# EAGLE design tester-7410 (EAGLE 6.6.0)

## Sheet 1 of 2
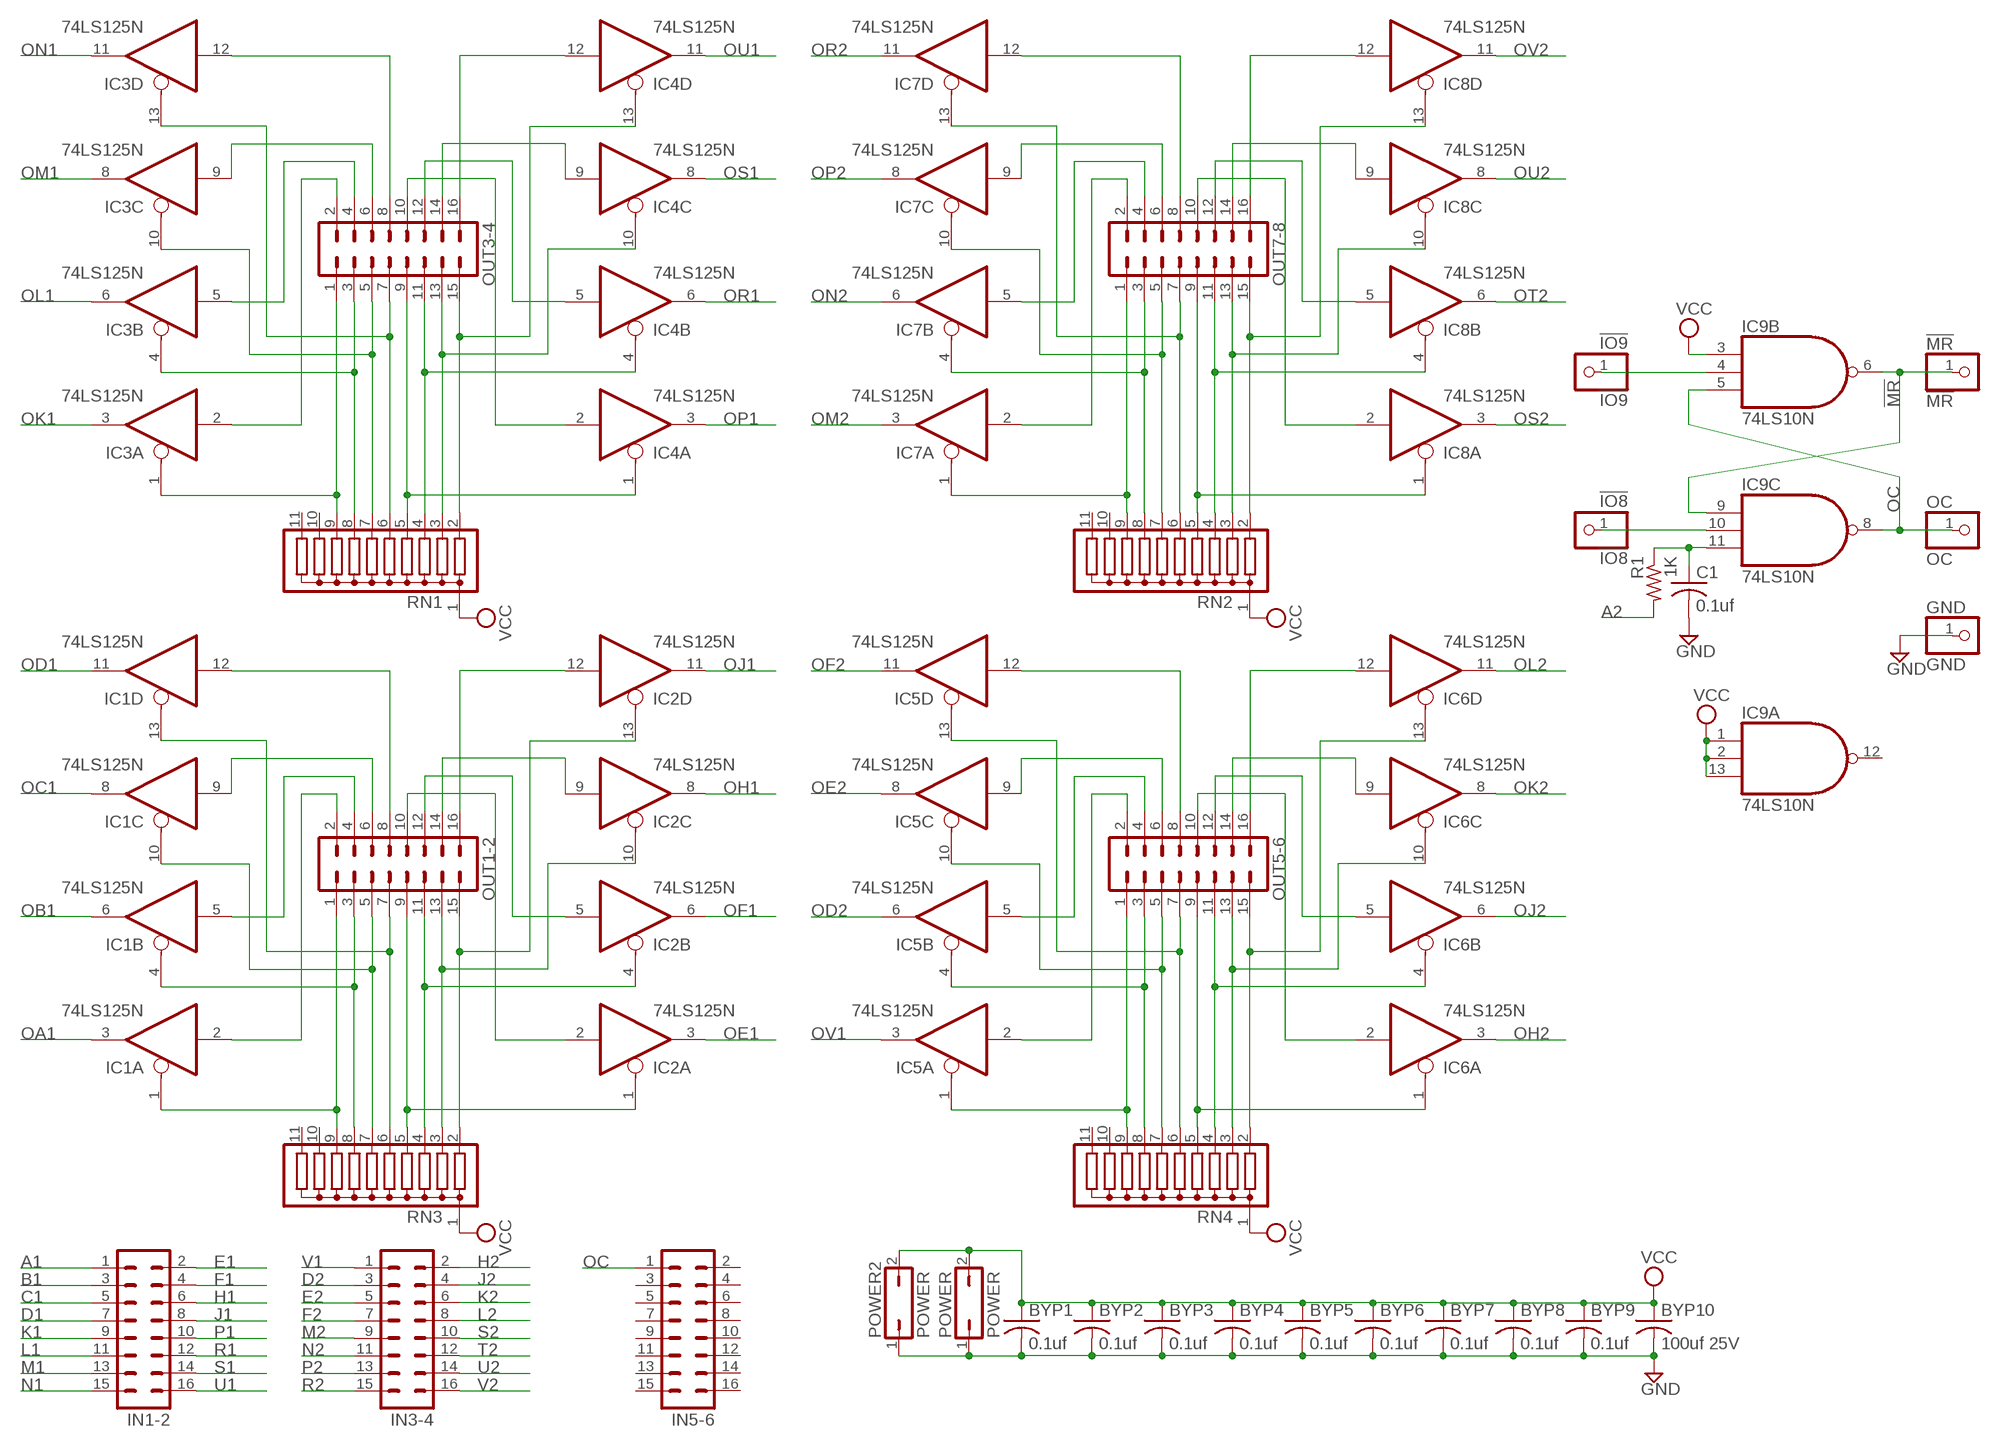
[diagram p0: schematic, sheet 1]

### Parts
!IO8  !IO8  PINHD-1X1  [1X01]
!IO9  !IO9  PINHD-1X1  [1X01]
!MR  !MR  PINHD-1X1  [1X01]
BYP1  0.1uf  C-US050-025X075  [C050-025X075]
BYP2  0.1uf  C-US050-025X075  [C050-025X075]
BYP3  0.1uf  C-US050-025X075  [C050-025X075]
BYP4  0.1uf  C-US050-025X075  [C050-025X075]
BYP5  0.1uf  C-US050-025X075  [C050-025X075]
BYP6  0.1uf  C-US050-025X075  [C050-025X075]
BYP7  0.1uf  C-US050-025X075  [C050-025X075]
BYP8  0.1uf  C-US050-025X075  [C050-025X075]
BYP9  0.1uf  C-US050-025X075  [C050-025X075]
BYP10  100uf 25V  C-US150-064X183  [C150-064X183]
C1  0.1uf  C-US050-025X075  [C050-025X075]
GND  GND  PINHD-1X1  [1X01]
IC1  74LS125N  [DIL14]
IC2  74LS125N  [DIL14]
IC3  74LS125N  [DIL14]
IC4  74LS125N  [DIL14]
IC5  74LS125N  [DIL14]
IC6  74LS125N  [DIL14]
IC7  74LS125N  [DIL14]
IC8  74LS125N  [DIL14]
IC9  74LS10N  [DIL14]
IN1-2  MA08-2  [MA08-2]
IN3-4  MA08-2  [MA08-2]
IN5-6  MA08-2  [MA08-2]
OC  OC  PINHD-1X1  [1X01]
OUT1-2  MA08-2  [MA08-2]
OUT3-4  MA08-2  [MA08-2]
OUT5-6  MA08-2  [MA08-2]
OUT7-8  MA08-2  [MA08-2]
POWER  POWER  JP1Q  [JP1]
POWER2  POWER  JP1Q  [JP1]
R1  1K  R-US_0207/10  [0207/10]
RN1  G10R  [SIL11]
RN2  G10R  [SIL11]
RN3  G10R  [SIL11]
RN4  G10R  [SIL11]

### Nets
!IO8: !IO8.1 IC9.10(C:I1)
!IO9: !IO9.1 IC9.4(B:I1)
!MR: !MR.1 IC9.6(B:O) IC9.9(C:I0)
A1: IN1-2.1 ; also sheet 2
A2: R1.2 ; also sheet 2
B1: IN1-2.3 ; also sheet 2
C1: IN1-2.5 ; also sheet 2
D1: IN1-2.7 ; also sheet 2
D2: IN3-4.3 ; also sheet 2
E1: IN1-2.2 ; also sheet 2
E2: IN3-4.5 ; also sheet 2
F1: IN1-2.4 ; also sheet 2
F2: IN3-4.7 ; also sheet 2
GND [Power]: BYP1.2 BYP2.2 BYP3.2 BYP4.2 BYP5.2 BYP6.2 BYP7.2 BYP8.2 BYP9.2 BYP10.2 C1.2 GND.1 POWER2.1 POWER.1 ; also sheet 2
H1: IN1-2.6 ; also sheet 2
H2: IN3-4.2 ; also sheet 2
J1: IN1-2.8 ; also sheet 2
J2: IN3-4.4 ; also sheet 2
K1: IN1-2.9 ; also sheet 2
K2: IN3-4.6 ; also sheet 2
L1: IN1-2.11 ; also sheet 2
L2: IN3-4.8 ; also sheet 2
M1: IN1-2.13 ; also sheet 2
M2: IN3-4.9 ; also sheet 2
N1: IN1-2.15 ; also sheet 2
N2: IN3-4.11 ; also sheet 2
N$5: C1.1 IC9.11(C:I2) R1.1
N$53: IC1.1(A:OE) OUT1-2.1 RN3.9
N$54: IC1.4(B:OE) OUT1-2.3 RN3.8
N$55: IC1.10(C:OE) OUT1-2.5 RN3.7
N$56: IC1.13(D:OE) OUT1-2.7 RN3.6
N$57: IC1.2(A:I) OUT1-2.2
N$58: IC1.5(B:I) OUT1-2.4
N$59: IC1.9(C:I) OUT1-2.6
N$60: IC1.12(D:I) OUT1-2.8
N$61: IC5.4(B:OE) OUT5-6.3 RN4.8
N$62: IC2.10(C:OE) OUT1-2.13 RN3.3
N$63: IC2.4(B:OE) OUT1-2.11 RN3.4
N$64: IC2.1(A:OE) OUT1-2.9 RN3.5
N$65: IC2.2(A:I) OUT1-2.10
N$66: IC2.5(B:I) OUT1-2.12
N$67: IC2.9(C:I) OUT1-2.14
N$68: IC2.12(D:I) OUT1-2.16
N$138: IC5.13(D:OE) OUT5-6.7 RN4.6
N$139: IC2.13(D:OE) OUT1-2.15 RN3.2
N$140: IC5.2(A:I) OUT5-6.2
N$141: IC5.5(B:I) OUT5-6.4
N$142: IC5.9(C:I) OUT5-6.6
N$143: IC5.12(D:I) OUT5-6.8
N$144: IC6.10(C:OE) OUT5-6.13 RN4.3
N$145: IC6.4(B:OE) OUT5-6.11 RN4.4
N$146: IC6.1(A:OE) OUT5-6.9 RN4.5
N$147: IC6.2(A:I) OUT5-6.10
N$148: IC6.9(C:I) OUT5-6.14
N$149: IC6.12(D:I) OUT5-6.16
N$150: IC5.1(A:OE) OUT5-6.1 RN4.9
N$151: IC5.10(C:OE) OUT5-6.5 RN4.7
N$152: IC6.5(B:I) OUT5-6.12
N$153: IC6.13(D:OE) OUT5-6.15 RN4.2
N$154: IC3.4(B:OE) OUT3-4.3 RN1.8
N$155: IC3.13(D:OE) OUT3-4.7 RN1.6
N$156: IC3.2(A:I) OUT3-4.2
N$157: IC3.5(B:I) OUT3-4.4
N$158: IC3.9(C:I) OUT3-4.6
N$159: IC3.12(D:I) OUT3-4.8
N$160: IC4.10(C:OE) OUT3-4.13 RN1.3
N$161: IC4.4(B:OE) OUT3-4.11 RN1.4
N$162: IC4.1(A:OE) OUT3-4.9 RN1.5
N$163: IC4.2(A:I) OUT3-4.10
N$164: IC4.9(C:I) OUT3-4.14
N$165: IC4.12(D:I) OUT3-4.16
N$166: IC3.1(A:OE) OUT3-4.1 RN1.9
N$167: IC3.10(C:OE) OUT3-4.5 RN1.7
N$168: IC4.5(B:I) OUT3-4.12
N$169: IC4.13(D:OE) OUT3-4.15 RN1.2
N$170: IC7.4(B:OE) OUT7-8.3 RN2.8
N$171: IC7.13(D:OE) OUT7-8.7 RN2.6
N$172: IC7.2(A:I) OUT7-8.2
N$173: IC7.5(B:I) OUT7-8.4
N$174: IC7.9(C:I) OUT7-8.6
N$175: IC7.12(D:I) OUT7-8.8
N$176: IC8.10(C:OE) OUT7-8.13 RN2.3
N$177: IC8.4(B:OE) OUT7-8.11 RN2.4
N$178: IC8.1(A:OE) OUT7-8.9 RN2.5
N$179: IC8.2(A:I) OUT7-8.10
N$180: IC8.9(C:I) OUT7-8.14
N$181: IC8.12(D:I) OUT7-8.16
N$182: IC7.1(A:OE) OUT7-8.1 RN2.9
N$183: IC7.10(C:OE) OUT7-8.5 RN2.7
N$184: IC8.5(B:I) OUT7-8.12
N$185: IC8.13(D:OE) OUT7-8.15 RN2.2
OA1: IC1.3(A:O) ; also sheet 2
OB1: IC1.6(B:O) ; also sheet 2
OC: IC9.5(B:I2) IC9.8(C:O) IN5-6.1 OC.1
OC1: IC1.8(C:O) ; also sheet 2
OD1: IC1.11(D:O) ; also sheet 2
OD2: IC5.6(B:O) ; also sheet 2
OE1: IC2.3(A:O) ; also sheet 2
OE2: IC5.8(C:O) ; also sheet 2
OF1: IC2.6(B:O) ; also sheet 2
OF2: IC5.11(D:O) ; also sheet 2
OH1: IC2.8(C:O) ; also sheet 2
OH2: IC6.3(A:O) ; also sheet 2
OJ1: IC2.11(D:O) ; also sheet 2
OJ2: IC6.6(B:O) ; also sheet 2
OK1: IC3.3(A:O) ; also sheet 2
OK2: IC6.8(C:O) ; also sheet 2
OL1: IC3.6(B:O) ; also sheet 2
OL2: IC6.11(D:O) ; also sheet 2
OM1: IC3.8(C:O) ; also sheet 2
OM2: IC7.3(A:O) ; also sheet 2
ON1: IC3.11(D:O) ; also sheet 2
ON2: IC7.6(B:O) ; also sheet 2
OP1: IC4.3(A:O) ; also sheet 2
OP2: IC7.8(C:O) ; also sheet 2
OR1: IC4.6(B:O) ; also sheet 2
OR2: IC7.11(D:O) ; also sheet 2
OS1: IC4.8(C:O) ; also sheet 2
OS2: IC8.3(A:O) ; also sheet 2
OT2: IC8.6(B:O) ; also sheet 2
OU1: IC4.11(D:O) ; also sheet 2
OU2: IC8.8(C:O) ; also sheet 2
OV1: IC5.3(A:O) ; also sheet 2
OV2: IC8.11(D:O) ; also sheet 2
P1: IN1-2.10 ; also sheet 2
P2: IN3-4.13 ; also sheet 2
R1: IN1-2.12 ; also sheet 2
R2: IN3-4.15 ; also sheet 2
S1: IN1-2.14 ; also sheet 2
S2: IN3-4.10 ; also sheet 2
T2: IN3-4.12 ; also sheet 2
U1: IN1-2.16 ; also sheet 2
U2: IN3-4.14 ; also sheet 2
V1: IN3-4.1 ; also sheet 2
V2: IN3-4.16 ; also sheet 2
VCC [Power]: BYP1.1 BYP2.1 BYP3.1 BYP4.1 BYP5.1 BYP6.1 BYP7.1 BYP8.1 BYP9.1 BYP10.1 IC9.1(A:I0) IC9.2(A:I1) IC9.3(B:I0) IC9.13(A:I2) POWER2.2 POWER.2 RN1.1 RN2.1 RN3.1 RN4.1 ; also sheet 2
Unconnected: IC9.12(A:O) IN5-6.2 IN5-6.3 IN5-6.4 IN5-6.5 IN5-6.6 IN5-6.7 IN5-6.8 IN5-6.9 IN5-6.10 IN5-6.11 IN5-6.12 IN5-6.13 IN5-6.14 IN5-6.15 IN5-6.16 RN1.10 RN1.11 RN2.10 RN2.11 RN3.10 RN3.11 RN4.10 RN4.11

## Sheet 2 of 2
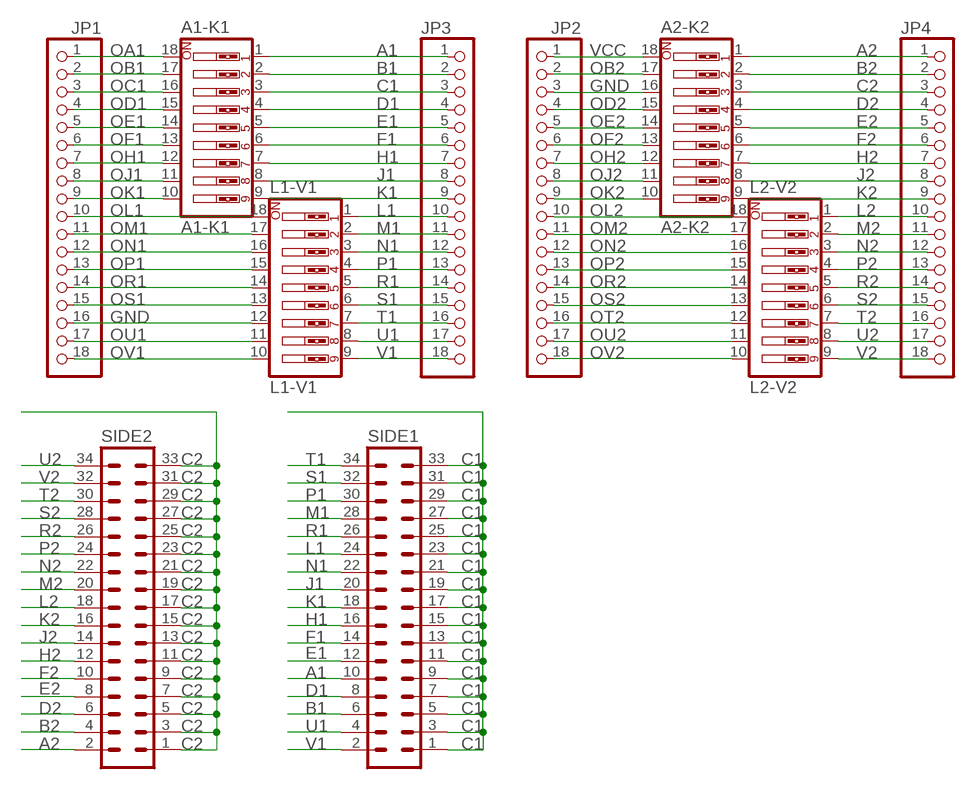
[diagram p1: schematic, sheet 2]

### Parts
A1-K1  A1-K1  SW_DIP-9  [EDG-09]
A2-K2  A2-K2  SW_DIP-9  [EDG-09]
JP1  PINHD-1X18  [1X18]
JP2  PINHD-1X18  [1X18]
JP3  PINHD-1X18  [1X18]
JP4  PINHD-1X18  [1X18]
L1-V1  L1-V1  SW_DIP-9  [EDG-09]
L2-V2  L2-V2  SW_DIP-9  [EDG-09]
SIDE1  MA17-2  [MA17-2]
SIDE2  MA17-2  [MA17-2]

### Nets
A1: A1-K1.1 JP3.1 SIDE1.10 ; also sheet 1
A2: A2-K2.1 JP4.1 SIDE2.2 ; also sheet 1
B1: A1-K1.2 JP3.2 SIDE1.6 ; also sheet 1
B2: A2-K2.2 JP4.2 SIDE2.4
C1: A1-K1.3 JP3.3 SIDE1.1 SIDE1.3 SIDE1.5 SIDE1.7 SIDE1.9 SIDE1.11 SIDE1.13 SIDE1.15 SIDE1.17 SIDE1.19 SIDE1.21 SIDE1.23 SIDE1.25 SIDE1.27 SIDE1.29 SIDE1.31 SIDE1.33 ; also sheet 1
C2: A2-K2.3 JP4.3 SIDE2.1 SIDE2.3 SIDE2.5 SIDE2.7 SIDE2.9 SIDE2.11 SIDE2.13 SIDE2.15 SIDE2.17 SIDE2.19 SIDE2.21 SIDE2.23 SIDE2.25 SIDE2.27 SIDE2.29 SIDE2.31 SIDE2.33
D1: A1-K1.4 JP3.4 SIDE1.8 ; also sheet 1
D2: A2-K2.4 JP4.4 SIDE2.6 ; also sheet 1
E1: A1-K1.5 JP3.5 SIDE1.12 ; also sheet 1
E2: A2-K2.5 JP4.5 SIDE2.8 ; also sheet 1
F1: A1-K1.6 JP3.6 SIDE1.14 ; also sheet 1
F2: A2-K2.6 JP4.6 SIDE2.10 ; also sheet 1
GND [Power]: A2-K2.16 JP1.16 JP2.3 L1-V1.12 ; also sheet 1
H1: A1-K1.7 JP3.7 SIDE1.16 ; also sheet 1
H2: A2-K2.7 JP4.7 SIDE2.12 ; also sheet 1
J1: A1-K1.8 JP3.8 SIDE1.20 ; also sheet 1
J2: A2-K2.8 JP4.8 SIDE2.14 ; also sheet 1
K1: A1-K1.9 JP3.9 SIDE1.18 ; also sheet 1
K2: A2-K2.9 JP4.9 SIDE2.16 ; also sheet 1
L1: JP3.10 L1-V1.1 SIDE1.24 ; also sheet 1
L2: JP4.10 L2-V2.1 SIDE2.18 ; also sheet 1
M1: JP3.11 L1-V1.2 SIDE1.28 ; also sheet 1
M2: JP4.11 L2-V2.2 SIDE2.20 ; also sheet 1
N1: JP3.12 L1-V1.3 SIDE1.22 ; also sheet 1
N2: JP4.12 L2-V2.3 SIDE2.22 ; also sheet 1
OA1: A1-K1.18 JP1.1 ; also sheet 1
OB1: A1-K1.17 JP1.2 ; also sheet 1
OB2: A2-K2.17 JP2.2
OC1: A1-K1.16 JP1.3 ; also sheet 1
OD1: A1-K1.15 JP1.4 ; also sheet 1
OD2: A2-K2.15 JP2.4 ; also sheet 1
OE1: A1-K1.14 JP1.5 ; also sheet 1
OE2: A2-K2.14 JP2.5 ; also sheet 1
OF1: A1-K1.13 JP1.6 ; also sheet 1
OF2: A2-K2.13 JP2.6 ; also sheet 1
OH1: A1-K1.12 JP1.7 ; also sheet 1
OH2: A2-K2.12 JP2.7 ; also sheet 1
OJ1: A1-K1.11 JP1.8 ; also sheet 1
OJ2: A2-K2.11 JP2.8 ; also sheet 1
OK1: A1-K1.10 JP1.9 ; also sheet 1
OK2: A2-K2.10 JP2.9 ; also sheet 1
OL1: JP1.10 L1-V1.18 ; also sheet 1
OL2: JP2.10 L2-V2.18 ; also sheet 1
OM1: JP1.11 L1-V1.17 ; also sheet 1
OM2: JP2.11 L2-V2.17 ; also sheet 1
ON1: JP1.12 L1-V1.16 ; also sheet 1
ON2: JP2.12 L2-V2.16 ; also sheet 1
OP1: JP1.13 L1-V1.15 ; also sheet 1
OP2: JP2.13 L2-V2.15 ; also sheet 1
OR1: JP1.14 L1-V1.14 ; also sheet 1
OR2: JP2.14 L2-V2.14 ; also sheet 1
OS1: JP1.15 L1-V1.13 ; also sheet 1
OS2: JP2.15 L2-V2.13 ; also sheet 1
OT2: JP2.16 L2-V2.12 ; also sheet 1
OU1: JP1.17 L1-V1.11 ; also sheet 1
OU2: JP2.17 L2-V2.11 ; also sheet 1
OV1: JP1.18 L1-V1.10 ; also sheet 1
OV2: JP2.18 L2-V2.10 ; also sheet 1
P1: JP3.13 L1-V1.4 SIDE1.30 ; also sheet 1
P2: JP4.13 L2-V2.4 SIDE2.24 ; also sheet 1
R1: JP3.14 L1-V1.5 SIDE1.26 ; also sheet 1
R2: JP4.14 L2-V2.5 SIDE2.26 ; also sheet 1
S1: JP3.15 L1-V1.6 SIDE1.32 ; also sheet 1
S2: JP4.15 L2-V2.6 SIDE2.28 ; also sheet 1
T1: JP3.16 L1-V1.7 SIDE1.34
T2: JP4.16 L2-V2.7 SIDE2.30 ; also sheet 1
U1: JP3.17 L1-V1.8 SIDE1.4 ; also sheet 1
U2: JP4.17 L2-V2.8 SIDE2.34 ; also sheet 1
V1: JP3.18 L1-V1.9 SIDE1.2 ; also sheet 1
V2: JP4.18 L2-V2.9 SIDE2.32 ; also sheet 1
VCC [Power]: A2-K2.18 JP2.1 ; also sheet 1

## Power pins joined to a net without a drawn wire
GND: IC1.7(P:GND) IC2.7(P:GND) IC3.7(P:GND) IC4.7(P:GND) IC5.7(P:GND) IC6.7(P:GND) IC7.7(P:GND) IC8.7(P:GND) IC9.7(P:GND)
VCC: IC1.14(P:VCC) IC2.14(P:VCC) IC3.14(P:VCC) IC4.14(P:VCC) IC5.14(P:VCC) IC6.14(P:VCC) IC7.14(P:VCC) IC8.14(P:VCC) IC9.14(P:VCC)

## Library data of the parts
!IO8 !IO9 !MR GND OC = pinhead:PINHD-1X1: PIN HEADER
A1-K1 A2-K2 L1-V1 L2-V2 = special:SW_DIP-9: DIP SWITCH
BYP1-BYP10 C1 = rcl:C-US: CAPACITOR, American symbol
IC1-IC8 = 74xx-us:74*125: Quad bus BUFFER, 3-state
IC9 = 74xx-us:74*10: Triple 3-input NAND gate
IN1-2 IN3-4 IN5-6 OUT1-2 OUT3-4 OUT5-6 OUT7-8 = con-lstb:MA08-2: PIN HEADER; OC_FARNELL: unknown; OC_NEWARK: unknown
JP1-JP4 = pinhead:PINHD-1X18: PIN HEADER
POWER POWER2 = jumper:JP1Q: JUMPER
R1 = rcl:R-US_: RESISTOR, American symbol
RN1-RN4 = resistor-sil:G10R: SIL RESISTOR; OC_FARNELL: unknown; OC_NEWARK: unknown
SIDE1 SIDE2 = con-lstb:MA17-2: PIN HEADER; OC_FARNELL: unknown; OC_NEWARK: unknown

## Net classes
1 Power: width 0.305 mm, clearance 0.305 mm

## Board
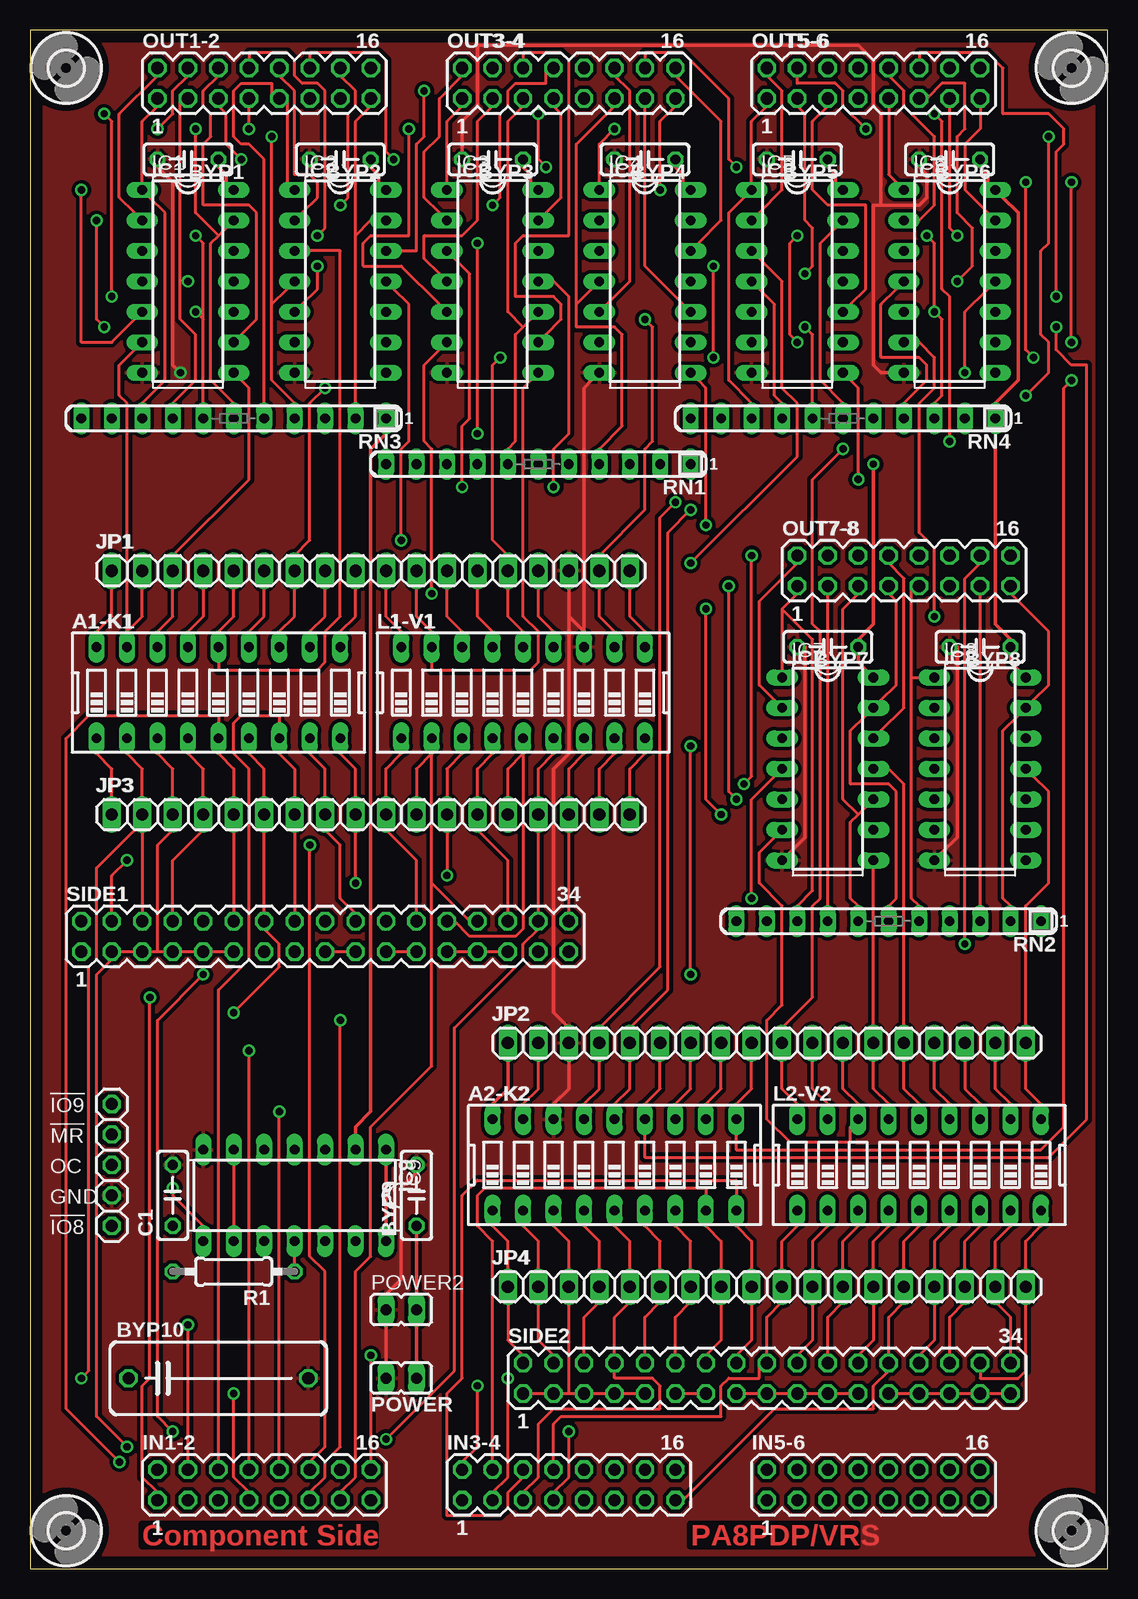
[diagram p2: board, top side]
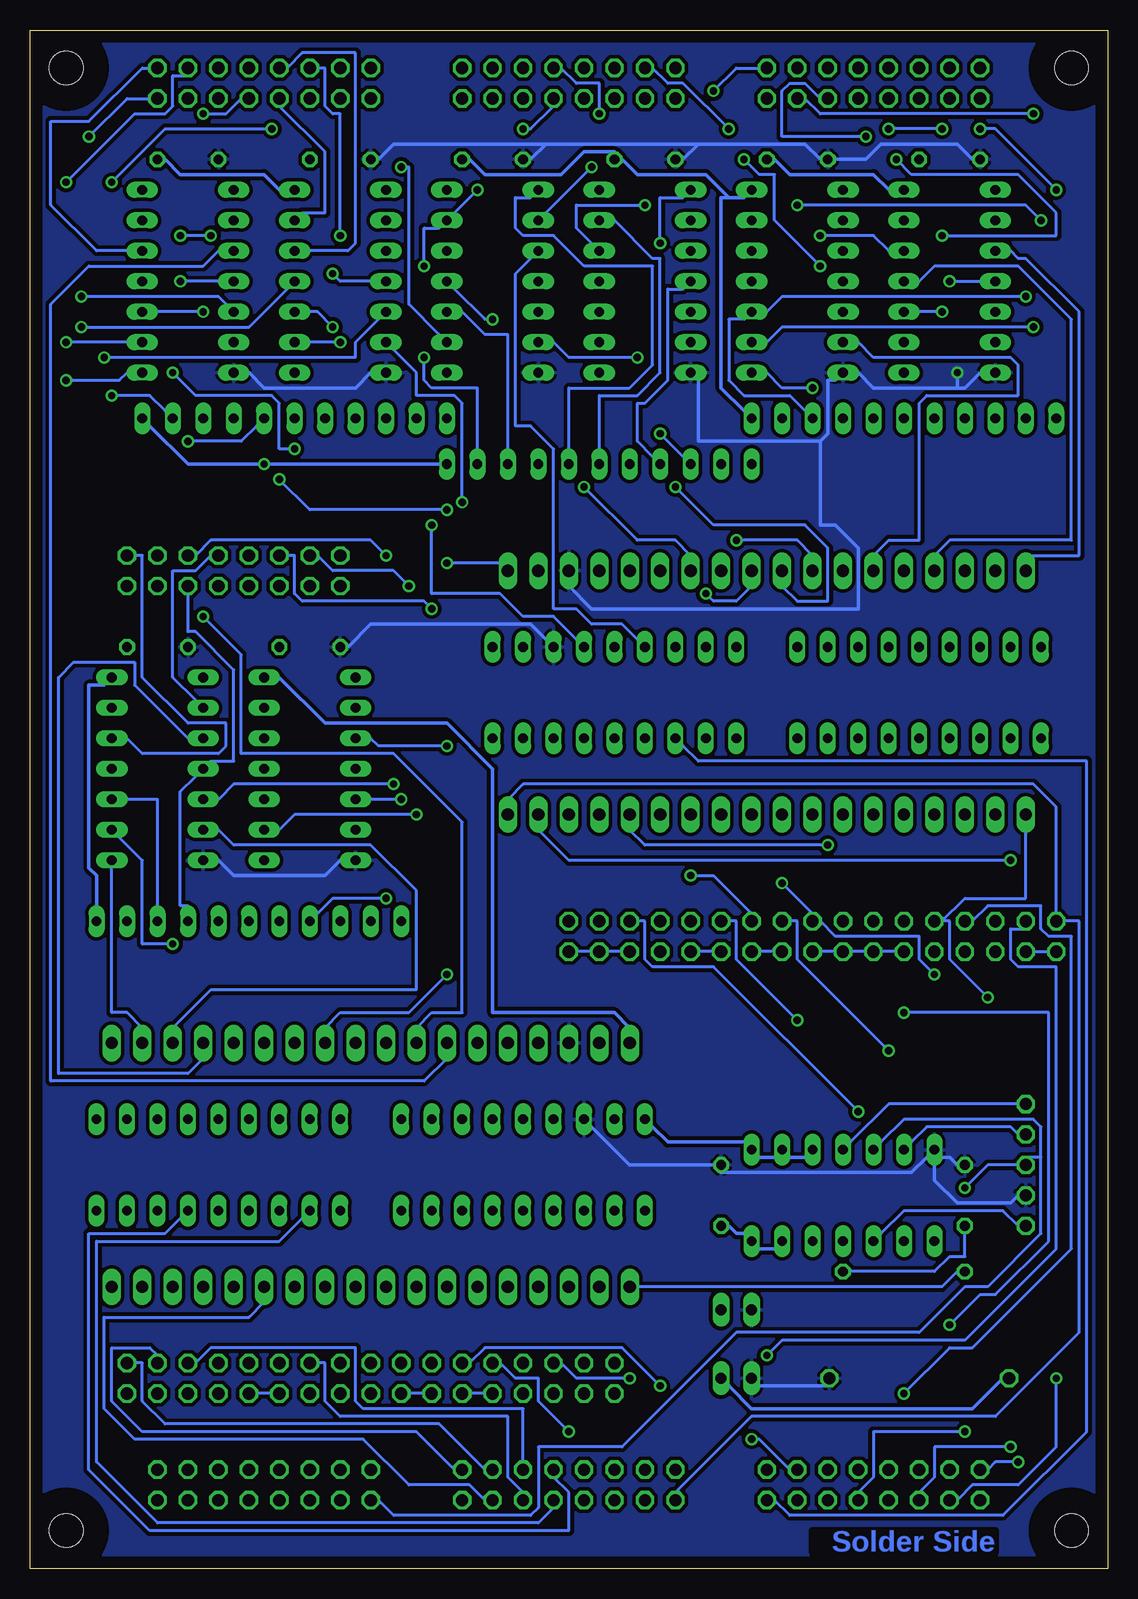
[diagram p3: board, bottom side, seen from below]

Size 89.84 x 128.25 mm. Coordinates in mm from the lower left corner, seen from the top.
Outline: 0,128.25 0,0 89.84,0 89.84,128.25 0,128.25
Copper layers (1*16): Top 0.035mm / dielectric 1.5mm / Bottom 0.035mm
Design rules "custompcb": minimum track width 10mil, minimum drill 24mil, track to track 12mil, track to pad 12mil, pad to pad 12mil, via to via 12mil, smd to smd 12mil, copper to edge 40mil, drill to drill 12mil, minimum pad ring 10mil, minimum via ring 8mil, stop-mask expansion 0mil, vias tented up to drill 0mil, thermal gap 10mil

### Footprints (pad centres in the part's own frame; a part is rotated, then mirrored left to right if it is on the bottom)
1X01 = drill 1.016 octagon: 1 0,0
EDG-09 = drill 0.813 long: 1 -10.16,-3.81; 2 -7.62,-3.81; 3 -5.08,-3.81; 4 -2.54,-3.81; 5 0,-3.81; 6 2.54,-3.81; 7 5.08,-3.81; 8 7.62,-3.81; 9 10.16,-3.81; 10 10.16,3.81; 11 7.62,3.81; 12 5.08,3.81; 13 2.54,3.81; 14 0,3.81; 15 -2.54,3.81; 16 -5.08,3.81; 17 -7.62,3.81; 18 -10.16,3.81
C050-025X075 = drill 0.813 octagon: 1 -2.54,0; 2 2.54,0
C150-064X183 = drill 1.016 octagon: 1 -7.493,0; 2 7.493,0
DIL14 = drill 0.813 long: 1 -7.62,-3.81; 2 -5.08,-3.81; 3 -2.54,-3.81; 4 0,-3.81; 5 2.54,-3.81; 6 5.08,-3.81; 7 7.62,-3.81; 8 7.62,3.81; 9 5.08,3.81; 10 2.54,3.81; 11 0,3.81; 12 -2.54,3.81; 13 -5.08,3.81; 14 -7.62,3.81
MA08-2 = drill 1.016 octagon: 1 -8.89,-1.27; 2 -8.89,1.27; 3 -6.35,-1.27; 4 -6.35,1.27; 5 -3.81,-1.27; 6 -3.81,1.27; 7 -1.27,-1.27; 8 -1.27,1.27; 9 1.27,-1.27; 10 1.27,1.27; 11 3.81,-1.27; 12 3.81,1.27; 13 6.35,-1.27; 14 6.35,1.27; 15 8.89,-1.27; 16 8.89,1.27
1X18 = drill 1.016 long: 1 -21.59,0; 2 -19.05,0; 3 -16.51,0; 4 -13.97,0; 5 -11.43,0; 6 -8.89,0; 7 -6.35,0; 8 -3.81,0; 9 -1.27,0; 10 1.27,0; 11 3.81,0; 12 6.35,0; 13 8.89,0; 14 11.43,0; 15 13.97,0; 16 16.51,0; 17 19.05,0; 18 21.59,0
JP1 = drill 0.914 long: 1 0,-1.27; 2 0,1.27
0207/10 = drill 0.813 octagon: 1 -5.08,0; 2 5.08,0
SIL11 = drill 0.813 long: 1 -12.7,0; 2 -10.16,0; 3 -7.62,0; 4 -5.08,0; 5 -2.54,0; 6 0,0; 7 2.54,0; 8 5.08,0; 9 7.62,0; 10 10.16,0; 11 12.7,0
MA17-2 = drill 1.016 octagon: 1 -20.32,-1.27; 2 -20.32,1.27; 3 -17.78,-1.27; 4 -17.78,1.27; 5 -15.24,-1.27; 6 -15.24,1.27; 7 -12.7,-1.27; 8 -12.7,1.27; 9 -10.16,-1.27; 10 -10.16,1.27; 11 -7.62,-1.27; 12 -7.62,1.27; 13 -5.08,-1.27; 14 -5.08,1.27; 15 -2.54,-1.27; 16 -2.54,1.27; 17 0,-1.27; 18 0,1.27; 19 2.54,-1.27; 20 2.54,1.27; 21 5.08,-1.27; 22 5.08,1.27; 23 7.62,-1.27; 24 7.62,1.27; 25 10.16,-1.27; 26 10.16,1.27; 27 12.7,-1.27; 28 12.7,1.27; 29 15.24,-1.27; 30 15.24,1.27; 31 17.78,-1.27; 32 17.78,1.27; 33 20.32,-1.27; 34 20.32,1.27
2,8 = hole 2.8: 0,0

### Placement (x,y rotation side)
!IO8  6.82,28.56 90 top
!IO9  6.82,38.72 90 top
!MR  6.82,36.18 90 top
A1-K1  15.71,73.01 0 top
A2-K2  48.73,33.64 0 top
BYP1  13.17,117.46 180 top
BYP2  25.87,117.46 180 top
BYP3  38.57,117.46 180 top
BYP4  51.27,117.46 180 top
BYP5  63.97,117.46 180 top
BYP6  76.67,117.46 180 top
BYP7  66.51,76.82 180 top
BYP8  79.21,76.82 180 top
BYP9  32.22,31.1 90 top
BYP10  15.71,15.86 0 top
C1  11.9,31.1 90 top
GND  6.82,31.1 90 top
IC1  13.17,107.3 270 top
IC2  25.87,107.3 270 top
IC3  38.57,107.3 270 top
IC4  51.27,107.3 270 top
IC5  63.97,107.3 270 top
IC6  76.67,107.3 270 top
IC7  66.51,66.66 270 top
IC8  79.21,66.66 270 top
IC9  22.06,31.1 180 top
IN1-2  19.52,6.97 0 top
IN3-4  44.92,6.97 0 top
IN5-6  70.32,6.97 0 top
JP1  28.41,83.17 0 top
JP2  61.43,43.8 0 top
JP3  28.41,62.85 0 top
JP4  61.43,23.48 0 top
L1-V1  41.11,73.01 0 top
L2-V2  74.13,33.64 0 top
OC  6.82,33.64 90 top
OUT1-2  19.52,123.81 0 top
OUT3-4  44.92,123.81 0 top
OUT5-6  70.32,123.81 0 top
OUT7-8  72.86,83.17 0 top
POWER  30.95,15.86 270 top
POWER2  30.95,21.57 270 top
R1  16.98,24.75 180 top
RN1  42.38,92.06 180 top
RN2  71.59,53.96 180 top
RN3  16.98,95.87 180 top
RN4  67.78,95.87 180 top
SIDE1  24.6,52.69 0 top
SIDE2  61.43,15.86 0 top
U$1  [2,8]  3.01,3.16 270 top
U$2  [2,8]  86.83,3.16 270 top
U$3  [2,8]  86.83,125.08 270 top
U$4  [2,8]  3.01,125.08 270 top

### Tracks (layer width: path | path; a pad name or v marks a point on that pad's centre or on a via)
!IO8
  Bottom 0.254: IC9.10 18.89,27.93 16.98,29.83 8.73,29.83 7.46,28.56 !IO8.1
!IO9
  Bottom 0.254: IC9.4 21.43,35.55 18.25,38.72 7.46,38.72 !IO9.1
!MR
  Top 0.254: IC9.9 16.98,28.56 16.98,33.64 IC9.6
  Bottom 0.254: !MR.1 7.46,36.18 8.09,36.81 15.08,36.81 16.35,35.55 IC9.6
A1  (via drill 0.61)
  Top 0.254: A1-K1.1 5.55,67.93 6.82,66.66 6.82,64.12 JP3.1 | v10,47.61 10,15.86 9.36,15.22 9.36,7.61 10.63,6.33 IN1-2.1
  Bottom 0.254: v10,47.61 13.17,50.78 13.17,53.96 13.81,53.96 | 13.81,53.96 SIDE1.10 13.81,53.96 | 13.81,53.96 11.9,55.87 6.82,55.87 6.82,61.58 JP3.1
A2
  Top 0.254: A2-K2.1 38.57,28.56 39.84,27.29 39.84,24.75 JP4.1 39.84,22.21 39.84,19.04 41.11,17.77 SIDE2.2
  Bottom 0.254: R1.2 12.54,24.75 13.81,23.48 39.2,23.48 JP4.1
B1  (via drill 0.61)
  Top 0.254: A1-K1.2 8.09,67.93 9.36,66.66 9.36,64.12 JP3.2 | SIDE1.6 9.36,54.59 9.36,61.58 JP3.2 | v4.28,15.86 4.92,16.5 4.92,50.15 5.55,50.78 5.55,58.41 8.73,61.58 8.73,62.21 JP3.2
  Bottom 0.254: v4.28,15.86 4.28,10.14 7.46,6.97 11.27,6.97 12.54,5.7 IN1-2.3
B2
  Top 0.254: A2-K2.2 41.11,28.56 42.38,27.29 42.38,24.75 JP4.2 42.38,22.21 42.38,19.04 43.65,17.77 SIDE2.4
C1  (via drill 0.61)
  Top 0.254: A1-K1.3 10.63,67.93 11.9,66.66 11.9,64.12 JP3.3 11.9,61.58 10.63,60.31 10.63,51.42 | v8.09,10.14 5.55,12.68 5.55,49.52 6.82,50.78 SIDE1.3 7.46,51.42 8.73,51.42 SIDE1.5 10,51.42 10.63,51.42 | 10.63,51.42 11.27,51.42 SIDE1.7 12.54,51.42 13.81,51.42 SIDE1.9 15.08,51.42 16.35,51.42 SIDE1.11 | SIDE1.19 26.51,51.42 25.23,51.42 SIDE1.17 | SIDE1.23 31.59,51.42 30.32,51.42 SIDE1.21 | SIDE1.25 35.4,51.42 36.66,51.42 SIDE1.27 37.94,51.42 39.2,51.42 SIDE1.29
  Bottom 0.254: v8.09,10.14 14.44,10.14 14.44,7.61 15.71,6.33 IN1-2.5 | SIDE1.1 4.92,51.42 6.18,51.42 SIDE1.3 | SIDE1.11 17.62,51.42 18.89,51.42 SIDE1.13 20.16,51.42 21.43,51.42 SIDE1.15 22.7,51.42 23.96,51.42 SIDE1.17 | SIDE1.21 29.05,51.42 27.78,51.42 SIDE1.19 | SIDE1.25 34.12,51.42 32.86,51.42 SIDE1.23 | SIDE1.29 40.48,51.42 41.74,51.42 SIDE1.31 43.02,51.42 44.29,51.42 SIDE1.33
C2
  Top 0.254: A2-K2.3 43.65,28.56 44.92,27.29 44.92,24.75 JP4.3 44.92,22.21 44.92,14.59 | SIDE2.1 41.74,14.59 43.02,14.59 SIDE2.3 44.29,14.59 44.92,14.59 | 44.92,14.59 45.55,14.59 SIDE2.5 46.83,14.59 48.09,14.59 SIDE2.7 49.37,14.59 50.63,14.59 SIDE2.9 | SIDE2.13 55.72,14.59 54.45,14.59 SIDE2.11 | SIDE2.15 59.52,14.59 60.8,14.59 SIDE2.17 62.06,14.59 63.34,14.59 SIDE2.19 64.6,14.59 65.88,14.59 SIDE2.21 67.14,14.59 68.41,14.59 SIDE2.23 | SIDE2.25 72.22,14.59 73.49,14.59 SIDE2.27 74.77,14.59 76.03,14.59 SIDE2.29 77.3,14.59 78.57,14.59 SIDE2.31 79.84,14.59 81.11,14.59 SIDE2.33
  Bottom 0.254: SIDE2.11 53.18,14.59 51.91,14.59 SIDE2.9 | SIDE2.15 58.26,14.59 56.98,14.59 SIDE2.13 | SIDE2.25 70.95,14.59 69.68,14.59 SIDE2.23
D1  (via drill 0.61)
  Top 0.254: A1-K1.4 13.17,67.93 14.44,66.66 14.44,64.12 JP3.4 14.44,61.58 11.9,59.04 11.9,54.59 SIDE1.8 | v16.98,14.59 16.98,7.61 18.25,6.33 IN1-2.7
  Bottom 0.254: v16.98,14.59 13.17,18.4 11.27,18.4 3.01,26.66 3.01,52.69 4.92,52.69 5.55,53.33 5.55,55.23 10,55.23 11.27,53.96 SIDE1.8
D2  (via drill 0.61)
  Top 0.254: A2-K2.4 46.19,28.56 47.46,27.29 47.46,24.75 JP4.4 47.46,22.21 46.19,20.94 46.19,17.77 SIDE2.6 | v39.84,15.86 39.84,7.61 38.57,6.33 IN3-4.3
  Bottom 0.254: v39.84,15.86 44.29,15.86 45.55,17.13 SIDE2.6
E1  (via drill 0.61)
  Top 0.254: v7.46,8.88 3.01,13.32 3.01,69.2 4.92,71.11 15.71,71.11 15.71,70.47 A1-K1.5 15.71,67.93 16.98,66.66 16.98,64.12 JP3.5 16.98,61.58 16.98,54.59 SIDE1.12
  Bottom 0.254: v7.46,8.88 9.36,8.88 10,8.24 IN1-2.2
E2
  Top 0.254: A2-K2.5 48.73,28.56 50,27.29 50,24.75 JP4.5 50,22.21 48.73,20.94 48.73,17.77 SIDE2.8 48.73,16.5 48.73,15.86 51.91,15.86 52.54,15.22 52.54,13.32 43.65,13.32 42.38,12.05 42.38,7.61 41.11,6.33 IN3-4.5
F1  (via drill 0.61)
  Top 0.254: A1-K1.6 18.25,67.93 19.52,66.66 19.52,64.12 JP3.6 19.52,61.58 19.52,54.59 SIDE1.14 19.52,53.33 20.79,52.05 20.79,50.15 v16.98,46.34 | v13.17,20.3 13.17,8.88 IN1-2.4
  Bottom 0.254: v13.17,20.3 10.63,22.84 9.36,22.84 4.92,27.29 4.92,46.34 v16.98,46.34
F2  (via drill 0.61)
  Top 0.254: A2-K2.6 51.27,28.56 52.54,27.29 52.54,24.75 JP4.6 52.54,22.21 51.27,20.94 51.27,17.77 SIDE2.10 | v44.92,11.41 44.92,7.61 43.65,6.33 IN3-4.7
  Bottom 0.254: v44.92,11.41 47.46,13.96 47.46,15.86 49.37,15.86 50.63,17.13 SIDE2.10
GND  (via drill 0.61)
  Top 0.305: 70.95,113.65 70.32,113.65 70.32,100.31 70.95,99.68 71.59,99.68 IC6.7 | 70.95,113.65 74.13,113.65 74.77,114.28 74.77,116.19 74.13,116.83 BYP6.2 | 70.95,113.65 70.95,121.27 70.32,121.91 70.32,125.72 69.05,126.98 37.3,126.98 37.3,121.91 36.03,120.64 36.03,118.09 BYP3.2 | A2-K2.16 43.65,38.72 44.92,39.99 44.92,42.53 JP2.3 44.92,45.07 43.65,46.34 43.65,66.66 44.92,67.93 44.92,79.36 | BYP9.2 32.22,33.01 30.95,31.73 30.95,24.11 29.68,22.84 POWER2.1 29.68,20.3 29.68,17.13 POWER.1 | 44.92,79.36 46.19,78.09 | 44.92,79.36 44.92,81.9 JP1.16 | 46.19,78.09 L1-V1.12 46.19,78.09 | 46.19,78.09 46.19,98.41 46.83,99.05 IC4.7 | IC7.7 63.34,59.67 64.6,60.95 64.6,76.82 BYP7.2 | IC8.7 76.03,59.67 77.3,60.95 77.3,76.82 BYP8.2 | v12.54,99.68 11.9,100.31 11.9,115.55 10.63,116.83 BYP1.2
  Bottom 0.305: IC5.7 61.43,99.68 62.7,98.41 70.32,98.41 71.59,99.68 IC6.7 | BYP1.2 11.27,117.46 12.54,118.73 18.89,118.73 20.16,117.46 22.7,117.46 BYP2.2 23.96,117.46 25.23,118.73 34.12,118.73 | 34.12,118.73 35.4,117.46 BYP3.2 | 46.83,118.73 48.09,117.46 BYP4.2 | 34.12,118.73 46.83,118.73 | 46.83,118.73 59.52,118.73 60.8,117.46 BYP5.2 | C1.2 12.54,33.64 13.17,34.27 13.81,34.27 IC9.7 | GND.1 7.46,31.1 8.09,30.46 12.54,30.46 14.44,32.37 14.44,33.64 IC9.7 | BYP10.2 23.33,15.22 29.05,15.22 POWER.1 | A2-K2.16 43.02,36.81 39.84,33.64 32.86,33.64 BYP9.2 32.22,33.01 16.35,33.01 15.08,34.27 IC9.7 | 12.54,98.41 19.52,98.41 20.79,99.68 IC2.7 22.7,99.05 23.33,99.05 23.33,94.6 23.96,93.97 | 12.54,98.41 11.9,98.41 10.63,99.68 IC1.7 | 23.96,93.97 34.12,93.97 34.12,99.05 IC3.7 | IC7.7 63.97,59.04 65.24,57.77 72.86,57.77 74.13,59.04 IC8.7 | L1-V1.12 46.83,77.45 48.09,78.72 61.43,78.72 63.34,76.82 BYP7.2 | 23.96,93.97 23.96,86.98 22.7,86.98 20.79,85.08 20.79,80 43.02,80 44.92,81.9 JP1.16 | 12.54,98.41 v12.54,99.68
  pour Bottom: -0.17,-0.01 -0.17,128.26 90,128.26 90,-0.01
  pour Top: -0.17,-0.01 -0.17,128.26 90,128.26 90,-0.01
H1
  Top 0.254: IN1-2.6 15.71,8.88 15.71,48.24 18.25,50.78 18.25,66.66 16.98,67.93 16.98,70.47 17.62,71.11 20.79,71.11 20.79,70.47 A1-K1.7 20.79,67.93 22.06,66.66 22.06,64.12 JP3.7 22.06,61.58 22.06,54.59 SIDE1.16
H2  (via drill 0.61)
  Top 0.254: A2-K2.7 53.81,28.56 55.08,27.29 55.08,24.75 JP4.7 55.08,22.21 53.81,20.94 53.81,17.77 SIDE2.12 | v37.3,15.22 37.3,10.14 36.03,8.88 IN3-4.2
  Bottom 0.254: v37.3,15.22 40.48,18.4 51.91,18.4 53.18,17.13 SIDE2.12
J1  (via drill 0.61)
  Top 0.254: A1-K1.8 23.33,67.93 24.6,66.66 24.6,64.12 JP3.8 24.6,61.58 25.87,60.31 25.87,55.87 27.14,54.59 SIDE1.20 | v18.25,43.16 18.25,8.88 IN1-2.8
  Bottom 0.254: v18.25,43.16 25.87,50.78 25.87,53.96 26.51,53.96 SIDE1.20
J2
  Top 0.254: IN3-4.4 38.57,8.88 38.57,27.29 37.3,28.56 37.3,31.1 37.94,31.73 56.35,31.73 56.35,31.1 A2-K2.8 56.35,28.56 57.62,27.29 57.62,24.75 JP4.8 57.62,22.21 57.62,19.04 56.35,17.77 SIDE2.14
K1  (via drill 0.61)
  Top 0.254: A1-K1.9 25.87,67.93 27.14,66.66 27.14,64.12 JP3.9 27.14,61.58 v27.14,57.13 | v11.9,11.41 10.63,12.68 10.63,45.7 v14.44,49.52
  Bottom 0.254: v11.9,11.41 19.52,11.41 19.52,7.61 20.79,6.33 IN1-2.9 | v14.44,49.52 15.71,50.78 15.71,52.69 22.7,52.69 23.96,53.96 SIDE1.18 24.6,54.59 v27.14,57.13
K2
  Top 0.254: IN3-4.6 41.11,7.61 39.84,6.33 39.84,5.07 39.2,4.43 34.76,4.43 34.76,14.59 36.03,15.86 36.03,31.1 37.3,32.37 58.89,32.37 58.89,31.1 A2-K2.9 58.89,28.56 60.16,27.29 60.16,24.75 JP4.9 60.16,22.21 60.16,19.04 58.89,17.77 SIDE2.16
L1  (via drill 0.61)
  Top 0.254: L1-V1.1 30.95,67.93 29.68,66.66 29.68,64.12 JP3.10 29.68,61.58 32.22,59.04 32.22,54.59 SIDE1.24 | v25.87,45.7 25.87,10.14 24.6,8.88 24.6,7.61 23.33,6.33 IN1-2.11
  Bottom 0.254: v25.87,45.7 30.95,50.78 30.95,53.96 31.59,53.96 SIDE1.24
L2
  Top 0.254: L2-V2.1 63.97,28.56 62.7,27.29 62.7,24.75 JP4.10 62.7,22.21 61.43,20.94 61.43,17.77 SIDE2.18 60.8,17.13 60.8,15.86 58.26,15.86 57.62,15.22 57.62,12.68 44.29,12.68 43.65,12.05 43.65,8.88 IN3-4.8
M1
  Top 0.254: 33.49,67.93 32.22,66.66 32.22,64.12 JP3.11 | 33.49,67.93 L1-V1.2 33.49,67.93 | 33.49,57.13 33.49,67.93 | 33.49,57.13 33.49,41.89 28.41,36.81 28.41,26.02 27.14,24.75 27.14,7.61 25.87,6.33 IN1-2.13 | 33.49,57.13 36.66,53.96 SIDE1.28
M2
  Top 0.254: L2-V2.2 66.51,28.56 65.24,27.29 65.24,24.75 JP4.11 65.24,22.21 65.24,19.04 63.97,17.77 SIDE2.20
  Bottom 0.254: IN3-4.9 46.19,5.07 47.46,3.79 79.21,3.79 84.29,8.88 84.29,27.29 69.05,27.29 67.14,29.2 L2-V2.2
N1  (via drill 0.61)
  Top 0.254: L1-V1.3 36.03,67.93 34.76,66.66 34.76,64.12 JP3.12 34.76,61.58 v34.76,57.77
  Bottom 0.254: IN1-2.15 27.78,5.7 26.51,4.43 8.73,4.43 1.74,11.41 1.74,67.3 34.12,67.3 35.4,68.56 L1-V1.3 | v34.76,57.77 32.86,57.77 29.68,54.59 SIDE1.22
N2
  Top 0.254: L2-V2.3 69.05,28.56 67.78,27.29 67.78,24.75 JP4.12 67.78,22.21 66.51,20.94 66.51,17.77 SIDE2.22
  Bottom 0.254: IN3-4.11 48.73,6.33 50,7.61 50,12.68 63.97,12.68 65.24,13.96 65.24,17.13 65.88,17.13 SIDE2.22
N$5
  Top 0.254: R1.1 22.06,25.38 22.06,26.02 IC9.11
  Bottom 0.254: C1.1 11.9,27.93 11.9,26.02 13.17,26.02 14.44,24.75 21.43,24.75 R1.1
N$53
  Top 0.254: RN3.9 9.36,97.14 11.27,99.05 11.27,113.02 10,114.28 IC1.1 9.36,115.55 9.36,120.64 10.63,121.91 OUT1-2.1
N$54  (via drill 0.61)
  Top 0.254: 12.54,107.3 12.54,122.54 OUT1-2.3 | 12.54,107.3 12.54,104.12 13.81,102.86 13.81,99.05 11.9,97.14 RN3.8 | 12.54,107.3 v13.17,107.3
  Bottom 0.254: v13.17,107.3 10.63,107.3 IC1.4
N$55  (via drill 0.61)
  Top 0.254: 14.44,104.12 14.44,97.14 RN3.7 | 14.44,104.12 v13.81,104.76 | v17.62,117.46 16.35,118.73 16.35,121.27 15.71,121.91 OUT1-2.5 | v13.81,111.11 14.44,110.47 14.44,104.12
  Bottom 0.254: v13.81,104.76 15.71,104.76 IC1.10 | v17.62,117.46 16.35,116.19 7.46,116.19 4.28,113.02 4.28,111.11 v13.81,111.11
N$56  (via drill 0.61)
  Top 0.254: 15.71,111.11 16.35,111.75 IC1.13 | 15.71,111.11 15.08,110.47 15.08,99.05 16.98,97.14 RN3.6 | v18.25,120 18.25,121.91 OUT1-2.7 | v13.81,120 13.81,113.02 15.71,111.11
  Bottom 0.254: v13.81,120 v18.25,120
N$57
  Top 0.254: IC1.2 8.73,113.02 7.46,114.28 7.46,121.27 10.63,124.44 OUT1-2.2
N$58  (via drill 0.61)
  Top 0.254: v4.28,114.92 4.28,102.22 6.82,102.22 8.73,104.12 IC1.5 | v10.63,120 11.9,121.27 11.9,123.17 13.17,124.44 OUT1-2.4
  Bottom 0.254: v4.28,114.92 9.36,120 v10.63,120
N$59
  Top 0.254: IC1.9 17.62,102.86 18.89,104.12 18.89,113.02 18.25,113.65 14.44,113.65 14.44,118.73 15.08,119.36 15.08,121.27 14.44,121.91 14.44,123.17 15.71,124.44 OUT1-2.6
N$60  (via drill 0.61)
  Top 0.254: v23.96,111.11 24.6,111.75 24.6,123.17 23.96,123.81 22.7,123.81 22.06,124.44 22.06,125.72 21.43,126.35 18.25,126.35 18.25,125.72 OUT1-2.8
  Bottom 0.254: v23.96,111.11 19.52,111.11 18.25,109.84 IC1.12
N$61  (via drill 0.61)
  Top 0.254: RN4.8 62.7,97.14 62.06,97.78 62.06,105.39 60.8,106.67 IC5.4 | v64.6,107.94 65.24,108.57 65.24,111.75 64.6,112.38 64.6,121.27 63.97,121.91 OUT5-6.3
  Bottom 0.254: v64.6,107.94 63.97,107.3 61.43,107.3 IC5.4
N$62  (via drill 0.61)
  Top 0.254: v6.18,121.27 6.82,120.64 v6.82,106.03
  Bottom 0.254: RN3.3 25.23,96.5 26.51,97.78 30.32,97.78 31.59,99.05 31.59,104.12 30.32,104.12 IC2.10 28.41,104.76 27.14,106.03 v6.82,106.03 | v6.18,121.27 23.96,121.27 25.23,122.54 OUT1-2.13
N$63  (via drill 0.61)
  Top 0.254: 20.16,105.39 20.16,99.05 22.06,97.14 RN3.4 | 20.16,105.39 21.43,106.67 IC2.4 | 20.16,105.39 v20.16,119.36
  Bottom 0.254: v20.16,119.36 27.14,119.36 27.14,123.17 26.51,123.81 25.23,123.81 23.96,122.54 OUT1-2.11
N$64
  Top 0.254: RN3.5 19.52,97.14 19.52,117.46 18.25,118.73 17.62,118.73 16.98,119.36 16.98,123.17 17.62,123.81 20.16,123.81 20.16,122.54 OUT1-2.9 21.43,122.54 21.43,115.55 IC2.1
N$65
  Top 0.254: IC2.2 22.7,113.02 23.96,114.28 23.96,115.55 23.33,116.19 22.06,116.19 22.06,123.17 20.79,124.44 OUT1-2.10
N$66  (via drill 0.61)
  Top 0.254: v23.96,108.57 23.96,106.67 22.7,105.39 IC2.5 | v30.32,117.46 29.68,118.09 29.68,125.72 29.05,126.35 23.33,126.35 23.33,125.72 OUT1-2.12
  Bottom 0.254: v23.96,108.57 27.78,112.38 27.78,116.19 29.05,116.19 v30.32,117.46
N$67  (via drill 0.61)
  Top 0.254: v6.18,103.49 5.55,104.12 v5.55,112.38 | v25.87,113.65 26.51,114.28 26.51,121.27 27.14,121.91 27.14,123.17 25.87,124.44 OUT1-2.14
  Bottom 0.254: v6.18,103.49 27.14,103.49 28.41,102.22 IC2.9 | v5.55,112.38 6.82,113.65 v25.87,113.65
N$68  (via drill 0.61)
  Top 0.254: v32.86,123.17 32.86,119.36 32.22,118.73 32.22,109.84 30.95,109.84 IC2.12
  Bottom 0.254: v32.86,123.17 30.95,125.08 29.05,125.08 OUT1-2.16
N$138
  Top 0.254: RN4.6 67.78,97.14 65.88,99.05 65.88,110.47 67.14,111.75 IC5.13
  Bottom 0.254: OUT5-6.7 69.05,121.91 65.24,118.09 65.24,113.02 67.14,113.02 IC5.13
N$139
  Top 0.254: 27.14,111.11 27.14,97.14 RN3.2 | 27.14,111.11 28.41,112.38 IC2.13 | 27.14,111.11 27.14,120.64 28.41,121.91 OUT1-2.15
N$140
  Top 0.254: IC5.2 60.8,113.02 62.7,114.92 62.7,123.17 61.43,124.44 OUT5-6.2
N$141  (via drill 0.61)
  Top 0.254: v83.65,100.95 83.02,101.58 v83.02,115.55 | v69.68,120 67.78,121.91 67.78,123.17 67.14,123.81 63.97,123.81 63.97,124.44 OUT5-6.4
  Bottom 0.254: v83.65,100.95 62.7,100.95 62.7,102.22 60.8,104.12 IC5.5 | v83.02,115.55 78.57,120 v69.68,120
N$142  (via drill 0.61)
  Top 0.254: v63.97,102.22 63.34,102.86 63.34,110.47 v63.97,111.11
  Bottom 0.254: v63.97,102.22 66.51,102.22 IC5.9 | v63.97,111.11 63.97,121.27 64.6,121.27 65.24,121.91 65.24,125.08 65.88,125.08 OUT5-6.6
N$143
  Bottom 0.254: IC5.12 66.51,109.84 63.34,109.84 62.7,110.47 62.7,126.35 67.14,126.35 68.41,125.08 OUT5-6.8
N$144  (via drill 0.61)
  Top 0.254: RN4.3 75.4,97.14 76.03,97.78 76.03,104.12 v75.4,104.76 75.4,110.47 v74.77,111.11 | v77.3,111.11 76.67,111.75 76.67,121.91 OUT5-6.13
  Bottom 0.254: v75.4,104.76 79.21,104.76 IC6.10 | v74.77,111.11 v77.3,111.11
N$145  (via drill 0.61)
  Top 0.254: RN4.4 72.86,97.14 74.77,99.05 74.77,100.31 74.13,100.95 70.95,100.95 70.95,105.39 72.22,106.67 IC6.4 | v77.3,107.3 78.57,108.57 78.57,111.75 77.3,113.02 77.3,119.36 77.94,120 77.94,123.81 76.03,123.81 74.77,122.54 OUT5-6.11
  Bottom 0.254: v77.3,107.3 74.13,107.3 IC6.4
N$146  (via drill 0.61)
  Top 0.254: v76.67,93.97 76.67,106.03 76.03,106.67 76.03,120.64 v75.4,121.27 | IC6.1 72.22,115.55 71.59,116.19 71.59,121.91 OUT5-6.9
  Bottom 0.254: v76.67,93.97 72.22,93.97 70.95,95.23 RN4.5 | v75.4,121.27 73.49,121.27 72.22,122.54 OUT5-6.9
N$147
  Top 0.254: IC6.2 74.13,112.38 75.4,113.65 75.4,119.36 72.86,121.91 72.86,123.17 71.59,124.44 OUT5-6.10
N$148  (via drill 0.61)
  Top 0.254: v86.83,102.22 v86.83,115.55
  Bottom 0.254: v86.83,102.22 81.75,102.22 IC6.9 | v86.83,115.55 81.11,121.27 78.57,121.27 77.94,121.91 77.94,124.44 76.67,124.44 OUT5-6.14
N$149
  Bottom 0.254: IC6.12 81.75,109.84 84.29,109.84 88.1,113.65 88.1,120.64 84.92,120.64 80.48,125.08 79.84,125.08 OUT5-6.16
N$150
  Top 0.254: RN4.9 60.16,97.14 58.26,99.05 58.26,113.02 59.52,114.28 IC5.1 60.16,115.55 60.16,120.64 61.43,121.91 OUT5-6.1
N$151  (via drill 0.61)
  Top 0.254: v64.6,103.49 65.24,102.86 65.24,97.14 RN4.7 | OUT5-6.5 66.51,121.91 65.24,120.64 65.24,114.92 66.51,113.65 69.68,113.65 69.68,106.67 68.41,105.39 IC5.10
  Bottom 0.254: v64.6,103.49 65.88,104.76 66.51,104.76 IC5.10
N$152  (via drill 0.61)
  Top 0.254: v85.56,106.03 85.56,118.09 86.19,118.73 86.19,120 84.92,121.27 81.11,121.27 81.11,125.08 79.84,126.35 74.13,126.35 74.13,125.72 OUT5-6.12
  Bottom 0.254: v85.56,106.03 74.13,106.03 73.49,105.39 IC6.5
N$153  (via drill 0.61)
  Top 0.254: v83.02,97.78 84.92,99.68 84.92,102.22 84.29,102.86 84.29,109.84 84.92,110.47 v84.92,119.36 | IC6.13 79.84,113.02 77.94,114.92 77.94,118.73 79.21,120 79.21,121.91 OUT5-6.15
  Bottom 0.254: v83.02,97.78 79.84,97.78 78.57,96.5 RN4.2 | v84.92,119.36 81.75,122.54 79.84,122.54 OUT5-6.15
N$154
  Top 0.254: OUT3-4.3 38.57,121.91 37.3,120.64 37.3,112.38 36.03,111.11 32.86,111.11 32.86,109.2 34.12,107.94 IC3.4
  Bottom 0.254: RN1.8 37.94,92.69 39.2,93.97 39.2,97.14 38.57,97.14 36.66,99.05 36.66,106.67 35.4,106.67 IC3.4
N$155
  Top 0.254: OUT3-4.7 43.65,121.91 44.29,121.27 44.29,114.28 43.02,113.02 IC3.13
  Bottom 0.254: RN1.6 42.38,93.33 42.38,97.78 39.2,97.78 37.3,99.68 37.3,109.2 37.94,109.2 41.11,112.38 IC3.13
N$156
  Top 0.254: IC3.2 34.12,113.02 32.86,114.28 32.86,118.09 34.12,119.36 34.12,122.54 36.03,124.44 OUT3-4.2
N$157  (via drill 0.61)
  Top 0.254: v31.59,120 31.59,111.11 28.41,111.11 27.78,110.47 27.78,108.57 30.95,108.57 34.12,105.39 IC3.5
  Bottom 0.254: v31.59,120 35.4,123.81 36.66,123.81 37.94,125.08 OUT3-4.4
N$158
  Top 0.254: IC3.9 43.02,102.86 44.29,104.12 44.29,105.39 43.65,106.03 40.48,106.03 40.48,110.47 41.11,111.11 44.92,111.11 44.92,125.72 44.29,126.35 41.11,126.35 41.11,125.72 OUT3-4.6
N$159  (via drill 0.61)
  Top 0.254: v38.57,113.65 39.2,114.28 39.2,121.27 39.84,121.91 39.84,123.17 40.48,123.81 43.02,123.81 43.02,125.08 OUT3-4.8
  Bottom 0.254: v38.57,113.65 44.29,113.65 44.29,111.75 43.02,110.47 IC3.12
N$160
  Top 0.254: OUT3-4.13 51.27,121.91 51.27,108.57 54.45,105.39 IC4.10
  Bottom 0.254: RN1.3 50,93.33 50,102.86 51.91,102.86 53.81,104.76 IC4.10
N$161
  Top 0.254: 45.55,105.39 45.55,103.49 48.73,103.49 49.37,102.86 49.37,95.23 47.46,93.33 RN1.4 | 45.55,105.39 46.83,106.67 IC4.4 | 45.55,105.39 45.55,118.73 48.73,121.91 OUT3-4.11
N$162  (via drill 0.61)
  Top 0.254: v48.73,120 47.46,118.73 47.46,115.55 IC4.1
  Bottom 0.254: RN1.5 44.92,93.33 44.92,98.41 39.84,98.41 37.94,100.31 37.94,108.57 43.65,108.57 46.19,111.11 48.73,111.11 49.37,111.75 49.37,114.28 48.09,114.28 IC4.1 | v48.73,120 48.09,120 46.19,121.91 OUT3-4.9
N$163  (via drill 0.61)
  Top 0.254: v43.02,116.83 42.38,117.46 v42.38,121.27
  Bottom 0.254: v43.02,116.83 46.83,113.02 IC4.2 | v42.38,121.27 42.38,123.81 44.29,123.81 45.55,125.08 OUT3-4.10
N$164  (via drill 0.61)
  Top 0.254: v58.89,116.83 58.26,117.46 58.26,122.54 54.45,126.35 51.27,126.35 51.27,125.72 OUT3-4.14
  Bottom 0.254: v58.89,116.83 58.26,116.83 58.26,105.39 55.72,102.86 IC4.9
N$165
  Top 0.254: IC4.12 55.72,110.47 57.62,112.38 57.62,120.64 53.81,124.44 OUT3-4.16
N$166  (via drill 0.61)
  Top 0.254: v37.3,94.6 v37.3,110.47 | OUT3-4.1 36.03,121.91 34.76,120.64 34.76,115.55 IC3.1
  Bottom 0.254: v37.3,94.6 35.4,92.69 RN1.9 | v37.3,110.47 37.3,114.28 35.4,114.28 IC3.1
N$167
  Top 0.254: 41.11,103.49 41.74,104.12 IC3.10 | 41.11,103.49 40.48,102.86 40.48,93.97 39.84,93.33 RN1.7 | 41.11,103.49 39.84,104.76 39.84,120.64 41.11,121.91 OUT3-4.5
N$168
  Top 0.254: IC4.5 48.09,105.39 50,107.3 50,123.17 48.73,124.44 OUT3-4.12
N$169  (via drill 0.61)
  Top 0.254: v56.98,100.95 v56.98,108.57 | v52.54,114.92 52.54,120.64 53.81,121.91 OUT3-4.15
  Bottom 0.254: v56.98,100.95 56.98,99.05 56.35,98.41 52.54,98.41 52.54,93.33 RN1.2 | v56.98,108.57 56.98,111.75 55.72,111.75 IC4.13 54.45,113.02 v52.54,114.92
N$170  (via drill 0.61)
  Top 0.254: RN2.8 66.51,55.23 66.51,81.27 OUT7-8.3 | v60.16,55.87 60.16,64.12 62.06,66.03 IC7.4
  Bottom 0.254: v60.16,55.87 64.6,55.87 65.88,54.59 RN2.8
N$171
  Top 0.254: RN2.6 71.59,55.23 72.22,55.87 72.22,64.75 71.59,65.39 68.41,65.39 68.41,69.83 69.68,71.11 IC7.13 70.95,72.38 72.22,73.64 72.22,80.63 71.59,81.27 OUT7-8.7
N$172
  Top 0.254: IC7.2 62.06,72.38 60.8,73.64 60.8,80.63 63.97,83.8 OUT7-8.2
N$173  (via drill 0.61)
  Top 0.254: v58.89,64.12 58.26,64.75 v58.26,81.9
  Bottom 0.254: v58.89,64.12 61.43,64.12 IC7.5 | v58.26,81.9 59.52,83.17 64.6,83.17 65.88,84.44 OUT7-8.4
N$174  (via drill 0.61)
  Top 0.254: v57.62,62.85 56.35,64.12 v56.35,80
  Bottom 0.254: v57.62,62.85 67.78,62.85 69.05,61.58 IC7.9 | v56.35,80 56.98,80.63 67.14,80.63 67.78,81.27 67.78,84.44 68.41,84.44 OUT7-8.6
N$175
  Top 0.254: IC7.12 70.95,69.83 72.86,71.74 72.86,82.53 71.59,83.8 OUT7-8.8
N$176
  Top 0.254: OUT7-8.13 79.21,81.27 79.21,55.23 RN2.3
  Bottom 0.254: RN2.3 79.21,55.23 79.21,64.12 81.75,64.12 IC8.10
N$177
  Bottom 0.254: RN2.4 76.67,55.23 77.3,55.23 77.3,64.75 76.03,66.03 IC8.4 74.77,67.3 72.86,67.3 72.86,74.92 76.03,78.09 76.67,78.09 76.67,81.27 OUT7-8.11
N$178
  Top 0.254: 73.49,74.28 73.49,81.9 OUT7-8.9 | 73.49,74.28 73.49,55.87 74.13,55.23 RN2.5 | 73.49,74.28 74.13,74.28 IC8.1
N$179
  Bottom 0.254: IC8.2 76.03,72.38 77.94,74.28 77.94,83.17 76.03,83.17 74.77,84.44 OUT7-8.10
N$180  (via drill 0.61)
  Top 0.254: v77.94,52.05 77.94,82.53 79.21,83.8 OUT7-8.14
  Bottom 0.254: v77.94,52.05 80.48,52.05 80.48,59.04 82.38,60.95 IC8.9
N$181
  Bottom 0.254: IC8.12 81.75,69.2 80.48,67.93 74.13,67.93 73.49,68.56 73.49,70.47 76.67,70.47 80.48,74.28 80.48,84.44 81.11,84.44 OUT7-8.16
N$182
  Top 0.254: 62.7,80 62.7,74.92 IC7.1 | 62.7,80 63.97,81.27 OUT7-8.1 | 62.7,80 65.24,77.45 65.24,56.5 63.97,55.23 RN2.9
N$183
  Top 0.254: 69.05,62.85 69.68,63.48 IC7.10 | 69.05,62.85 68.41,62.21 68.41,55.87 69.05,55.23 RN2.7 | 69.05,62.85 67.78,64.12 67.78,80 69.05,81.27 OUT7-8.5
N$184  (via drill 0.61)
  Top 0.254: v59.52,65.39 60.16,66.03 v60.16,84.44
  Bottom 0.254: v59.52,65.39 72.86,65.39 74.13,64.12 IC8.5 | v60.16,84.44 61.43,85.71 74.77,85.71 76.03,84.44 OUT7-8.12
N$185
  Top 0.254: RN2.2 81.75,55.23 81.11,55.87 81.11,69.83 82.38,71.11 IC8.13 83.65,72.38 84.92,73.64 84.92,78.09 81.75,81.27 OUT7-8.15
OA1
  Top 0.254: A1-K1.18 5.55,78.09 6.82,79.36 6.82,81.9 JP1.1
  Bottom 0.254: IC1.3 8.09,109.84 7.46,109.2 6.82,109.2 2.38,104.76 2.38,84.44 6.82,84.44 JP1.1
OB1
  Top 0.254: 8.09,78.09 9.36,79.36 9.36,81.9 JP1.2 | 8.09,78.09 A1-K1.17 8.09,78.09 | 8.09,78.09 8.09,97.14 7.46,97.78 7.46,100.31 8.73,101.58 IC1.6
OB2
  Top 0.254: A2-K2.17 41.11,38.72 42.38,39.99 42.38,42.53 JP2.2
OC  (via drill 0.61)
  Top 0.254: v11.9,31.73 11.9,31.1 14.44,28.56 IC9.8
  Bottom 0.254: v11.9,31.73 10,33.64 7.46,33.64 OC.1 6.82,34.27 5.55,34.27 | 5.55,34.27 5.55,36.81 6.18,37.45 16.98,37.45 18.89,35.55 IC9.5 | 5.55,34.27 5.55,27.93 10,23.48 11.9,23.48 15.71,19.67 30.95,19.67 40.48,10.14 47.46,10.14 47.46,5.07 48.09,4.43 59.52,4.43 60.8,5.7 IN5-6.1
OC1
  Top 0.254: A1-K1.16 10.63,78.09 11.9,79.36 11.9,81.9 JP1.3 11.9,84.44 18.25,90.79 18.25,98.41 17.62,99.05 IC1.8
OD1
  Top 0.254: A1-K1.15 13.17,78.09 14.44,79.36 14.44,81.9 JP1.4
  Bottom 0.254: IC1.11 15.71,107.3 14.44,108.57 7.46,108.57 3.01,104.12 3.01,85.71 13.17,85.71 14.44,84.44 JP1.4
OD2  (via drill 0.61)
  Top 0.254: A2-K2.15 46.19,38.72 47.46,39.99 47.46,42.53 JP2.4 47.46,45.07 52.54,50.15 52.54,87.61 v53.81,88.89
  Bottom 0.254: v53.81,88.89 53.81,97.14 54.45,97.78 57.62,97.78 57.62,99.68 59.52,101.58 IC5.6
OE1
  Top 0.254: JP1.5 16.98,81.9 16.98,79.36 15.71,78.09 A1-K1.14 15.71,75.55 15.71,74.92 23.96,74.92 24.6,75.55 24.6,78.09 25.87,79.36 25.87,109.84 23.33,109.84 IC2.3
OE2  (via drill 0.61)
  Top 0.254: A2-K2.14 48.73,38.72 50,39.99 50,42.53 JP2.5 50,45.07 53.18,48.24 53.18,86.34 v55.08,88.25 | v69.05,90.79 69.05,98.41 68.41,99.05 IC5.8
  Bottom 0.254: v69.05,90.79 66.51,88.25 v55.08,88.25
OF1
  Top 0.254: A1-K1.13 18.25,78.09 19.52,79.36 19.52,81.9 JP1.6
  Bottom 0.254: IC2.6 20.79,102.22 19.52,100.95 8.09,100.95 7.46,100.31 7.46,97.78 15.08,97.78 15.71,97.14 15.71,85.71 18.25,85.71 19.52,84.44 JP1.6
OF2  (via drill 0.61)
  Top 0.254: JP2.6 52.54,42.53 52.54,39.99 51.27,38.72 A2-K2.13 51.27,36.18 51.27,34.27 84.92,34.27 88.1,37.45 88.1,100.31 86.83,100.31 85.56,101.58 v85.56,103.49
  Bottom 0.254: v85.56,103.49 71.59,103.49 68.41,106.67 IC5.11
OH1  (via drill 0.61)
  Top 0.254: A1-K1.12 20.79,78.09 22.06,79.36 22.06,81.9 JP1.7 22.06,84.44 23.33,85.71 23.33,97.14 v24.6,98.41
  Bottom 0.254: v24.6,98.41 27.14,98.41 28.41,99.68 IC2.8
OH2
  Top 0.254: A2-K2.12 53.81,38.72 55.08,39.99 55.08,42.53 JP2.7
  Bottom 0.254: IC6.3 74.13,109.84 75.4,108.57 84.92,108.57 88.1,105.39 88.1,40.62 56.98,40.62 55.08,42.53 JP2.7
OJ1  (via drill 0.61)
  Top 0.254: A1-K1.11 23.33,78.09 24.6,79.36 24.6,81.9 JP1.8 | v30.95,85.71 30.95,93.33 31.59,93.97 31.59,105.39 30.32,106.67 IC2.11
  Bottom 0.254: v30.95,85.71 25.87,85.71 24.6,84.44 JP1.8
OJ2  (via drill 0.61)
  Top 0.254: A2-K2.11 56.35,38.72 57.62,39.99 57.62,42.53 JP2.8 | v75.4,79.36 75.4,85.08 74.13,86.34 74.13,97.14 75.4,98.41 75.4,100.95 74.13,102.22 IC6.6
  Bottom 0.254: v75.4,79.36 72.22,76.19 72.22,67.93 59.52,67.93 53.81,62.21 53.81,46.34 56.35,46.34 57.62,45.07 JP2.8
OK1  (via drill 0.61)
  Top 0.254: A1-K1.10 25.87,78.09 27.14,79.36 27.14,81.9 JP1.9 | v36.03,90.16 36.03,95.23 36.66,95.87 36.66,107.94 35.4,109.2 IC3.3
  Bottom 0.254: v36.03,90.16 32.86,86.98 25.23,86.98 23.33,85.08 23.33,80.63 25.87,80.63 27.14,81.9 JP1.9
OK2  (via drill 0.61)
  Top 0.254: JP2.9 60.16,42.53 60.16,39.99 58.89,38.72 A2-K2.10 58.89,36.18 58.89,34.91 84.29,34.91 86.19,36.81 86.19,98.41 v86.83,99.05
  Bottom 0.254: v86.83,99.05 82.38,99.05 81.75,99.68 IC6.8
OL1  (via drill 0.61)
  Top 0.254: L1-V1.18 30.95,78.09 29.68,79.36 29.68,81.9 JP1.10 | v33.49,81.27 33.49,93.33 32.86,93.97 32.86,100.31 34.12,101.58 IC3.6
  Bottom 0.254: v33.49,81.27 32.86,80.63 30.95,80.63 29.68,81.9 JP1.10
OL2  (via drill 0.61)
  Top 0.254: L2-V2.18 63.97,38.72 62.7,39.99 62.7,42.53 JP2.10 62.7,45.07 65.24,47.61 65.24,55.23 65.88,55.87 65.88,78.09 65.24,78.72 65.24,90.79 v67.78,93.33 | v77.94,99.68 77.94,104.76 79.84,106.67 IC6.11
  Bottom 0.254: v77.94,99.68 76.03,97.78 69.68,97.78 69.05,97.14 69.05,93.33 v67.78,93.33
OM1
  Top 0.254: JP1.11 32.22,81.9 32.22,79.36 33.49,78.09 L1-V1.17 33.49,75.55 33.49,74.92 41.74,74.92 42.38,75.55 42.38,78.09 41.11,79.36 41.11,98.41 41.74,99.05 IC3.8
OM2  (via drill 0.61)
  Top 0.254: L2-V2.17 66.51,38.72 65.24,39.99 65.24,42.53 JP2.11 | v55.08,49.52 v55.08,68.56
  Bottom 0.254: v55.08,68.56 60.8,68.56 61.43,69.2 IC7.3 | v55.08,49.52 58.26,46.34 63.97,46.34 65.24,45.07 JP2.11
ON1  (via drill 0.61)
  Top 0.254: L1-V1.16 36.03,78.09 34.76,79.36 34.76,81.9 JP1.12 | v43.65,90.16 43.65,93.33 44.92,94.6 44.92,106.03 43.65,107.3 IC3.11
  Bottom 0.254: v43.65,90.16 39.2,85.71 36.03,85.71 34.76,84.44 JP1.12
ON2
  Top 0.254: JP2.12 67.78,42.53 67.78,39.99 69.05,38.72 L2-V2.16 68.41,36.81 68.41,35.55 63.34,35.55 61.43,37.45 61.43,45.7 62.7,46.98 62.7,55.23 60.8,57.13 60.8,59.67 62.06,60.95 IC7.6
OP1
  Top 0.254: L1-V1.15 38.57,78.09 37.3,79.36 37.3,81.9 JP1.13
  Bottom 0.254: IC4.3 48.09,109.2 49.37,107.94 49.37,95.23 48.09,95.23 46.19,93.33 46.19,80 44.29,80 43.02,78.72 40.48,78.72 39.2,77.45 L1-V1.15
OP2
  Top 0.254: IC7.8 70.32,58.41 70.32,45.07 JP2.13 70.32,42.53 70.32,39.99 71.59,38.72 L2-V2.15
OR1  (via drill 0.61)
  Top 0.254: L1-V1.14 41.11,78.09 39.84,79.36 39.84,81.9 JP1.14 39.84,84.44 38.57,85.71 38.57,100.31 v39.2,100.95
  Bottom 0.254: v39.2,100.95 44.92,100.95 46.19,102.22 IC4.6
OR2
  Top 0.254: L2-V2.14 74.13,38.72 72.86,39.99 72.86,42.53 JP2.14 72.86,45.07 72.86,65.39 71.59,66.66 IC7.11
OS1  (via drill 0.61)
  Top 0.254: L1-V1.13 43.65,78.09 42.38,79.36 42.38,81.9 JP1.15 | v56.35,86.98 56.35,98.41 55.72,99.05 IC4.8
  Bottom 0.254: v56.35,86.98 56.35,81.27 50.63,81.27 48.73,79.36 46.19,79.36 44.29,77.45 L1-V1.13
OS2
  Top 0.254: L2-V2.13 76.67,38.72 75.4,39.99 75.4,42.53 JP2.15
  Bottom 0.254: IC8.3 76.67,69.2 81.11,73.64 81.11,75.55 86.19,75.55 87.46,74.28 87.46,41.26 76.67,41.26 75.4,42.53 JP2.15
OT2
  Top 0.254: L2-V2.12 79.21,38.72 77.94,39.99 77.94,42.53 JP2.16
  Bottom 0.254: IC8.6 74.13,61.58 72.86,60.31 61.43,60.31 57.62,56.5 57.62,48.24 74.77,48.24 77.94,45.07 JP2.16
OU1  (via drill 0.61)
  Top 0.254: L1-V1.11 48.73,78.09 47.46,79.36 47.46,81.9 JP1.17 47.46,84.44 51.27,88.25 51.27,93.33 51.91,93.97 51.91,103.49 v51.27,104.12
  Bottom 0.254: v51.27,104.12 51.91,104.12 54.45,106.67 IC4.11
OU2
  Top 0.254: L2-V2.11 81.75,38.72 80.48,39.99 80.48,42.53 JP2.17
  Bottom 0.254: IC8.8 83.02,58.41 83.02,46.34 81.75,46.34 80.48,45.07 JP2.17
OV1  (via drill 0.61)
  Top 0.254: L1-V1.10 51.27,78.09 50,79.36 50,81.9 JP1.18 | v55.08,83.8 63.97,92.69 63.97,97.14 62.7,98.41 62.7,107.3 60.8,109.2 IC5.3
  Bottom 0.254: v55.08,83.8 50.63,83.8 JP1.18
OV2
  Top 0.254: IC8.11 83.65,66.03 84.92,64.75 84.92,57.13 83.02,55.23 83.02,45.07 JP2.18 83.02,42.53 83.02,39.99 84.29,38.72 L2-V2.10
P1  (via drill 0.61)
  Top 0.254: L1-V1.4 38.57,67.93 37.3,66.66 37.3,64.12 JP3.13 37.3,61.58 39.84,59.04 39.84,54.59 SIDE1.30 | v20.79,38.09 20.79,8.88 IN1-2.10
  Bottom 0.254: v20.79,38.09 32.86,50.15 37.94,50.15 38.57,50.78 38.57,53.96 39.2,53.96 SIDE1.30
P2
  Top 0.254: L2-V2.4 71.59,28.56 70.32,27.29 70.32,24.75 JP4.13 70.32,22.21 70.32,19.04 69.05,17.77 SIDE2.24
  Bottom 0.254: IN3-4.13 51.91,5.7 53.18,6.97 58.26,6.97 62.06,10.78 81.11,10.78 83.65,13.32 83.65,20.94 71.59,20.94 70.32,22.21 JP4.13
R1  (via drill 0.61)
  Top 0.254: 41.11,67.93 39.84,66.66 39.84,64.12 JP3.14 | 41.11,67.93 L1-V1.5 41.11,67.93 | v23.33,60.31 23.33,26.02 24.6,24.75 24.6,10.14 23.33,8.88 IN1-2.12 | 41.11,67.93 41.11,53.33 40.48,52.69 36.66,52.69 35.4,53.96 SIDE1.26
  Bottom 0.254: v23.33,60.31 38.57,60.31 39.84,61.58 JP3.14
R2
  Top 0.254: L2-V2.5 74.13,28.56 72.86,27.29 72.86,24.75 JP4.14 72.86,22.21 71.59,20.94 71.59,17.77 SIDE2.26 71.59,16.5 70.32,15.22 70.32,13.32 62.06,13.32 54.45,5.7 IN3-4.15
S1  (via drill 0.61)
  Top 0.254: L1-V1.6 43.65,67.93 42.38,66.66 42.38,64.12 JP3.15 42.38,61.58 42.38,54.59 SIDE1.32 42.38,53.33 41.11,52.05 41.11,50.78 35.4,45.07 35.4,16.5 v29.68,10.78
  Bottom 0.254: v29.68,10.78 29.05,10.78 26.51,8.24 IN1-2.14
S2
  Top 0.254: L2-V2.6 76.67,28.56 75.4,27.29 75.4,24.75 JP4.15 75.4,22.21 75.4,19.04 74.13,17.77 SIDE2.28
  Bottom 0.254: IN3-4.10 46.19,7.61 44.92,6.33 44.92,3.16 79.84,3.16 84.92,8.24 84.92,27.93 78.57,27.93 77.3,29.2 L2-V2.6
T1
  Top 0.254: L1-V1.7 46.19,67.93 44.92,66.66 44.92,64.12 JP3.16 44.92,61.58 44.92,54.59 SIDE1.34
T2
  Top 0.254: L2-V2.7 79.21,28.56 77.94,27.29 77.94,24.75 JP4.16 77.94,22.21 76.67,20.94 76.67,17.77 SIDE2.30
  Bottom 0.254: IN3-4.12 48.73,8.88 48.73,13.32 62.06,13.32 62.7,13.96 62.7,18.4 74.77,18.4 76.03,17.13 SIDE2.30
U1  (via drill 0.61)
  Top 0.254: L1-V1.8 48.73,67.93 47.46,66.66 47.46,64.12 JP3.17 | v28.41,17.77 28.41,8.88 IN1-2.16 | v8.09,59.04 6.82,57.77 6.82,54.59 SIDE1.4
  Bottom 0.254: v28.41,17.77 27.14,19.04 11.9,19.04 4.28,26.66 4.28,50.15 7.46,50.15 8.09,50.78 8.09,53.33 6.82,53.33 SIDE1.4 | v8.09,59.04 44.92,59.04 47.46,61.58 JP3.17
U2
  Top 0.254: L2-V2.8 81.75,28.56 80.48,27.29 80.48,24.75 JP4.17 80.48,22.21 81.75,20.94 81.75,17.77 SIDE2.34
  Bottom 0.254: IN3-4.14 51.91,8.24 55.72,12.05 78.57,12.05 80.48,13.96 80.48,17.13 81.11,17.13 SIDE2.34
V1
  Top 0.254: L1-V1.9 51.27,67.93 50,66.66 50,64.12 JP3.18
  Bottom 0.254: IN3-4.1 36.03,6.33 29.68,12.68 9.36,12.68 2.38,19.67 2.38,53.96 3.65,53.96 SIDE1.2 4.28,54.59 4.28,63.48 6.18,65.39 48.73,65.39 50,64.12 JP3.18
V2
  Top 0.254: L2-V2.9 84.29,28.56 83.02,27.29 83.02,24.75 JP4.18 83.02,22.21 83.02,16.5 82.38,15.86 79.21,15.86 79.21,16.5 SIDE2.32
  Bottom 0.254: IN3-4.16 54.45,8.24 57.62,11.41 80.48,11.41 83.02,13.96 83.02,18.4 79.84,18.4 79.21,17.77 SIDE2.32
VCC  (via drill 0.61)
  Top 0.305: IC8.14 82.38,74.92 81.75,75.55 81.75,76.19 BYP8.1 81.75,77.45 80.48,78.72 80.48,94.6 RN4.1 80.48,97.14 82.38,99.05 82.38,113.02 81.11,114.28 IC6.14 79.84,115.55 79.84,116.19 79.21,116.83 BYP6.1 | BYP5.1 66.51,116.83 67.14,116.19 67.14,115.55 IC5.14 | IC7.14 69.68,74.92 69.05,75.55 69.05,76.19 BYP7.1 69.05,77.45 70.32,78.72 v70.32,92.06 | BYP4.1 53.81,116.83 54.45,116.19 54.45,115.55 IC4.14 | BYP3.1 41.11,116.83 41.74,116.19 41.74,115.55 IC3.14 | BYP1.1 15.71,116.83 16.35,116.19 16.35,115.55 IC1.14 | BYP2.1 28.41,116.83 29.05,116.19 29.05,115.55 IC2.14 | POWER.2 32.22,17.13 32.22,20.3 POWER2.2 32.22,22.84 32.22,27.93 BYP9.1 | A2-K2.18 38.57,38.72 39.84,39.99 39.84,42.53 JP2.1 | IC9.1 29.68,33.64 29.68,28.56 IC9.14 | RN3.1 29.68,94.6 28.41,93.33 28.41,38.09 27.14,36.81 27.14,36.18 IC9.2
  Bottom 0.305: RN2.1 84.29,55.23 84.29,57.77 84.92,58.41 84.92,73.64 83.65,73.64 IC8.14 | IC5.14 69.05,114.92 70.32,116.19 77.3,116.19 78.57,117.46 BYP6.1 | RN1.1 55.72,92.06 v70.32,92.06 76.67,92.06 79.84,95.23 RN4.1 | 31.59,114.28 30.32,114.28 IC2.14 | 31.59,114.28 32.22,114.28 32.22,98.41 30.32,96.5 RN3.1 | IC1.14 18.25,114.92 19.52,116.19 26.51,116.19 27.78,117.46 BYP2.1 | 31.59,114.28 33.49,116.19 39.2,116.19 40.48,117.46 BYP3.1 41.11,118.09 43.65,118.09 45.55,116.19 51.91,116.19 53.18,117.46 BYP4.1 | BYP10.1 8.73,15.86 11.27,13.32 29.68,13.32 31.59,15.22 POWER.2 | IC9.3 25.23,34.27 26.51,34.27 IC9.2 27.78,34.27 29.05,34.27 IC9.1 30.32,35.55 36.66,35.55 37.94,36.81 A2-K2.18 | IC9.13 27.78,26.66 29.05,26.66 IC9.14 30.32,27.93 30.95,27.93 31.59,28.56 BYP9.1 | IC7.14 69.05,74.28 65.24,70.47 55.08,70.47 51.27,66.66 51.27,46.34 41.11,46.34 39.84,45.07 JP2.1

### Text on the board
Top: Component Side | PA8PDP/VRS
Bottom: Solder Side
tPlace: 16 | 16 | 16 | 1 | 1 | 1 | 1 | 1 | 1 | 16 | 1 | 34 | 1 | 1 | 34 | 1 | 16 | 16 | 16 | 1 | 1 | 1
tNames: OUT3-4 | OUT5-6 | IC1 | IC2 | IC3 | IC4 | IC5 | IC6 | RN3 | RN4 | RN1 | OUT7-8 | JP1 | A1-K1 | L1-V1 | IC7 | IC8 | JP3 | SIDE1 | RN2 | JP2 | A2-K2 | L2-V2 | IC9 | C1 | BYP9 | JP4 | R1 | SIDE2
tValues: 74LS125N | 74LS125N | 74LS125N | 74LS125N | 74LS125N | 74LS125N | A1-K1 | L1-V1 | 74LS125N | 74LS125N | FlipChip Tester - Rev.1 | A2-K2 | L2-V2 | 74LS10N | 0.1uf | 0.1uf | 1K | - | + | + | -